# Altium project RK_NVR_DEMO1_RK3588_LP4XD200P232SD8_V21_20211228.PrjPcb (part 4 of 19)

## Sheet 17.RK3588_HDMI_eDP Interface.SchDoc
size 420 x 297 mm; Revision: V2.1; Schematic Page Number: 11; Page Number: 17; Check: <Checker>; Schematic Name: RK_NVR_DEMO1_RK3588_LP4/4x_V21; Page Count: 43; Page name: 17.RK3588_HDMI/eDP Interface; Designer: Zhangdz; Schematic Page Count: 99; Revcode: V2.1; DsnPath: E:\Work\SBER\RK3588_SOM\temp\RK_NVR_DEMO1_RK3588_LP4XD200P232SD8_V21_20211228.DSN; SchematicName: RK_NVR_DEMO1_RK3588_LP4/4x_V21; PageName: 17.RK3588_HDMI/eDP Interface; PageSize: A3; TopSchematic: True
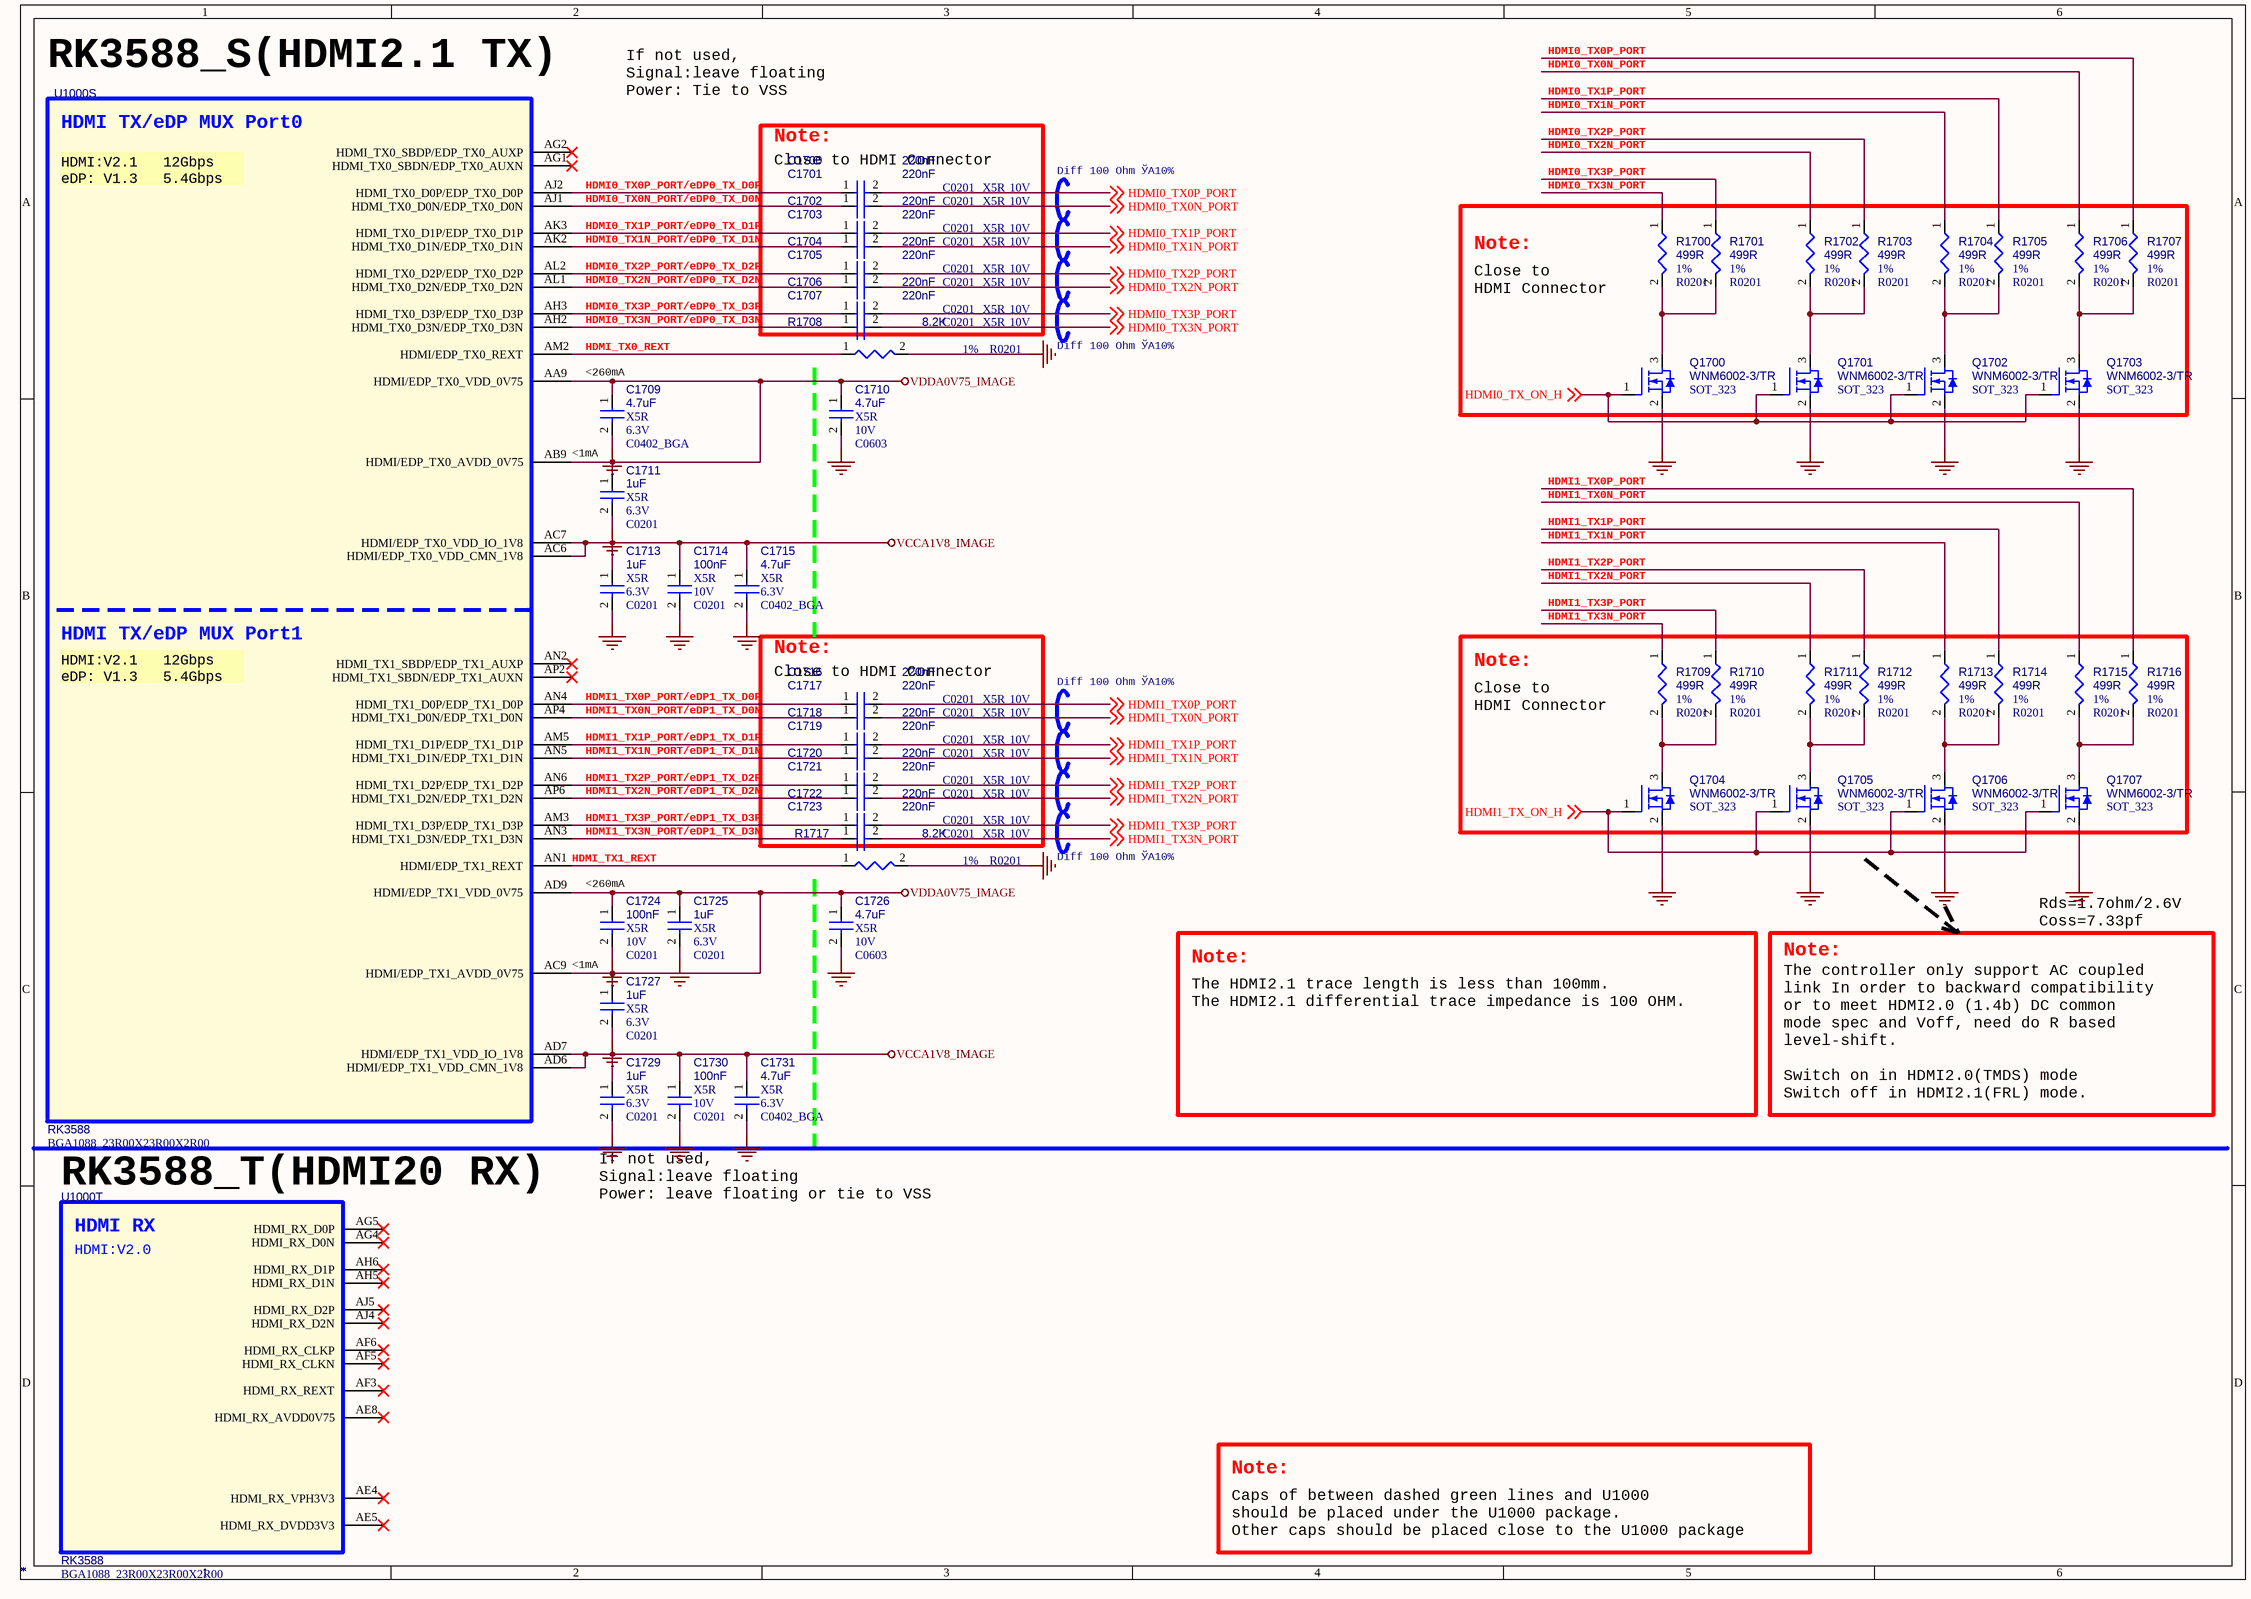
[diagram p32: 17.RK3588_HDMI_eDP Interface.SchDoc]

### Parts
C1700  *  Voltage: 10V  Dielectric: X5R  [C0201]
C1701  *  Voltage: 10V  Dielectric: X5R  [C0201]
C1702  *  Voltage: 10V  Dielectric: X5R  [C0201]
C1703  *  Voltage: 10V  Dielectric: X5R  [C0201]
C1704  *  Voltage: 10V  Dielectric: X5R  [C0201]
C1705  *  Voltage: 10V  Dielectric: X5R  [C0201]
C1706  *  Voltage: 10V  Dielectric: X5R  [C0201]
C1707  *  Voltage: 10V  Dielectric: X5R  [C0201]
C1709  *  Voltage: 6.3V  Dielectric: X5R  [C0402_BGA]
C1710  *  Voltage: 10V  Dielectric: X5R  [C0603]
C1711  *  Voltage: 6.3V  Dielectric: X5R  [C0201]
C1713  *  Voltage: 6.3V  Dielectric: X5R  [C0201]
C1714  *  Voltage: 10V  Dielectric: X5R  [C0201]
C1715  *  Voltage: 6.3V  Dielectric: X5R  [C0402_BGA]
C1716  *  Voltage: 10V  Dielectric: X5R  [C0201]
C1717  *  Voltage: 10V  Dielectric: X5R  [C0201]
C1718  *  Voltage: 10V  Dielectric: X5R  [C0201]
C1719  *  Voltage: 10V  Dielectric: X5R  [C0201]
C1720  *  Voltage: 10V  Dielectric: X5R  [C0201]
C1721  *  Voltage: 10V  Dielectric: X5R  [C0201]
C1722  *  Voltage: 10V  Dielectric: X5R  [C0201]
C1723  *  Voltage: 10V  Dielectric: X5R  [C0201]
C1724  *  Voltage: 10V  Dielectric: X5R  [C0201]
C1725  *  Voltage: 6.3V  Dielectric: X5R  [C0201]
C1726  *  Voltage: 10V  Dielectric: X5R  [C0603]
C1727  *  Voltage: 6.3V  Dielectric: X5R  [C0201]
C1729  *  Voltage: 6.3V  Dielectric: X5R  [C0201]
C1730  *  Voltage: 10V  Dielectric: X5R  [C0201]
C1731  *  Voltage: 6.3V  Dielectric: X5R  [C0402_BGA]
Q1700  *  PCB Footprint: SOT_323  [SOT23]
Q1701  *  PCB Footprint: SOT_323  [SOT23]
Q1702  *  PCB Footprint: SOT_323  [SOT23]
Q1703  *  PCB Footprint: SOT_323  [SOT23]
Q1704  *  PCB Footprint: SOT_323  [SOT23]
Q1705  *  PCB Footprint: SOT_323  [SOT23]
Q1706  *  PCB Footprint: SOT_323  [SOT23]
Q1707  *  PCB Footprint: SOT_323  [SOT23]
R1700  *  PCB Footprint: R0201  Tolerance: 1%  [R0402]
R1701  *  PCB Footprint: R0201  Tolerance: 1%  [R0402]
R1702  *  PCB Footprint: R0201  Tolerance: 1%  [R0402]
R1703  *  PCB Footprint: R0201  Tolerance: 1%  [R0402]
R1704  *  PCB Footprint: R0201  Tolerance: 1%  [R0402]
R1705  *  PCB Footprint: R0201  Tolerance: 1%  [R0402]
R1706  *  PCB Footprint: R0201  Tolerance: 1%  [R0402]
R1707  *  PCB Footprint: R0201  Tolerance: 1%  [R0402]
R1708  *  PCB Footprint: R0201  Tolerance: 1%  [R0402]
R1709  *  PCB Footprint: R0201  Tolerance: 1%  [R0402]
R1710  *  PCB Footprint: R0201  Tolerance: 1%  [R0402]
R1711  *  PCB Footprint: R0201  Tolerance: 1%  [R0402]
R1712  *  PCB Footprint: R0201  Tolerance: 1%  [R0402]
R1713  *  PCB Footprint: R0201  Tolerance: 1%  [R0402]
R1714  *  PCB Footprint: R0201  Tolerance: 1%  [R0402]
R1715  *  PCB Footprint: R0201  Tolerance: 1%  [R0402]
R1716  *  PCB Footprint: R0201  Tolerance: 1%  [R0402]
R1717  *  PCB Footprint: R0201  Tolerance: 1%  [R0402]
U1000  *  [BGA1088_23R00X23R00X2R00]  (parts S,T of 26)

### Blocks framed on the sheet
Note:: C1700-C1707
Note:: Q1700-Q1703 R1700-R1707
Note:: C1716-C1723
Note:: Q1704-Q1707 R1709-R1716

### Nets
GND: C1709.2 C1710.2 C1711.2 C1713.2 C1714.2 C1715.2 C1724.2 C1725.2 C1726.2 C1727.2 C1729.2 C1730.2 C1731.2 Q1700.2(SOURCE) Q1701.2(SOURCE) Q1702.2(SOURCE) Q1703.2(SOURCE) Q1704.2(SOURCE) Q1705.2(SOURCE) Q1706.2(SOURCE) Q1707.2(SOURCE) R1708.2 R1717.2
VCCA1V8_IMAGE: C1713.1 C1714.1 C1715.1 C1729.1 C1730.1 C1731.1 U1000.AC6(HDMI/EDP_TX0_VDD_CMN_1V8) U1000.AC7(HDMI/EDP_TX0_VDD_IO_1V8) U1000.AD6(HDMI/EDP_TX1_VDD_CMN_1V8) U1000.AD7(HDMI/EDP_TX1_VDD_IO_1V8)
VDDA0V75_IMAGE: C1709.1 C1710.1 C1711.1 C1724.1 C1725.1 C1726.1 C1727.1 U1000.AA9(HDMI/EDP_TX0_VDD_0V75) U1000.AB9(HDMI/EDP_TX0_AVDD_0V75) U1000.AC9(HDMI/EDP_TX1_AVDD_0V75) U1000.AD9(HDMI/EDP_TX1_VDD_0V75)
HDMI0_TX0N_PORT: C1701.2 R1706.1 ; off-sheet HDMI0_TX0N_PORT
HDMI0_TX0N_PORT/eDP0_TX_D0N: C1701.1 U1000.AJ1(HDMI_TX0_D0N/EDP_TX0_D0N)
HDMI0_TX0P_PORT: C1700.2 R1707.1 ; off-sheet HDMI0_TX0P_PORT
HDMI0_TX0P_PORT/eDP0_TX_D0P: C1700.1 U1000.AJ2(HDMI_TX0_D0P/EDP_TX0_D0P)
HDMI0_TX1N_PORT: C1703.2 R1704.1 ; off-sheet HDMI0_TX1N_PORT
HDMI0_TX1N_PORT/eDP0_TX_D1N: C1703.1 U1000.AK2(HDMI_TX0_D1N/EDP_TX0_D1N)
HDMI0_TX1P_PORT: C1702.2 R1705.1 ; off-sheet HDMI0_TX1P_PORT
HDMI0_TX1P_PORT/eDP0_TX_D1P: C1702.1 U1000.AK3(HDMI_TX0_D1P/EDP_TX0_D1P)
HDMI0_TX2N_PORT: C1705.2 R1702.1 ; off-sheet HDMI0_TX2N_PORT
HDMI0_TX2N_PORT/eDP0_TX_D2N: C1705.1 U1000.AL1(HDMI_TX0_D2N/EDP_TX0_D2N)
HDMI0_TX2P_PORT: C1704.2 R1703.1 ; off-sheet HDMI0_TX2P_PORT
HDMI0_TX2P_PORT/eDP0_TX_D2P: C1704.1 U1000.AL2(HDMI_TX0_D2P/EDP_TX0_D2P)
HDMI0_TX3N_PORT: C1707.2 R1700.1 ; off-sheet HDMI0_TX3N_PORT
HDMI0_TX3N_PORT/eDP0_TX_D3N: C1707.1 U1000.AH2(HDMI_TX0_D3N/EDP_TX0_D3N)
HDMI0_TX3P_PORT: C1706.2 R1701.1 ; off-sheet HDMI0_TX3P_PORT
HDMI0_TX3P_PORT/eDP0_TX_D3P: C1706.1 U1000.AH3(HDMI_TX0_D3P/EDP_TX0_D3P)
HDMI0_TX_ON_H: Q1700.1(GATE) Q1701.1(GATE) Q1702.1(GATE) Q1703.1(GATE) ; off-sheet HDMI0_TX_ON_H
HDMI1_TX0N_PORT: C1717.2 R1715.1 ; off-sheet HDMI1_TX0N_PORT
HDMI1_TX0N_PORT/eDP1_TX_D0N: C1717.1 U1000.AP4(HDMI_TX1_D0N/EDP_TX1_D0N)
HDMI1_TX0P_PORT: C1716.2 R1716.1 ; off-sheet HDMI1_TX0P_PORT
HDMI1_TX0P_PORT/eDP1_TX_D0P: C1716.1 U1000.AN4(HDMI_TX1_D0P/EDP_TX1_D0P)
HDMI1_TX1N_PORT: C1719.2 R1713.1 ; off-sheet HDMI1_TX1N_PORT
HDMI1_TX1N_PORT/eDP1_TX_D1N: C1719.1 U1000.AN5(HDMI_TX1_D1N/EDP_TX1_D1N)
HDMI1_TX1P_PORT: C1718.2 R1714.1 ; off-sheet HDMI1_TX1P_PORT
HDMI1_TX1P_PORT/eDP1_TX_D1P: C1718.1 U1000.AM5(HDMI_TX1_D1P/EDP_TX1_D1P)
HDMI1_TX2N_PORT: C1721.2 R1711.1 ; off-sheet HDMI1_TX2N_PORT
HDMI1_TX2N_PORT/eDP1_TX_D2N: C1721.1 U1000.AP6(HDMI_TX1_D2N/EDP_TX1_D2N)
HDMI1_TX2P_PORT: C1720.2 R1712.1 ; off-sheet HDMI1_TX2P_PORT
HDMI1_TX2P_PORT/eDP1_TX_D2P: C1720.1 U1000.AN6(HDMI_TX1_D2P/EDP_TX1_D2P)
HDMI1_TX3N_PORT: C1723.2 R1709.1 ; off-sheet HDMI1_TX3N_PORT
HDMI1_TX3N_PORT/eDP1_TX_D3N: C1723.1 U1000.AN3(HDMI_TX1_D3N/EDP_TX1_D3N)
HDMI1_TX3P_PORT: C1722.2 R1710.1 ; off-sheet HDMI1_TX3P_PORT
HDMI1_TX3P_PORT/eDP1_TX_D3P: C1722.1 U1000.AM3(HDMI_TX1_D3P/EDP_TX1_D3P)
HDMI1_TX_ON_H: Q1704.1(GATE) Q1705.1(GATE) Q1706.1(GATE) Q1707.1(GATE) ; off-sheet HDMI1_TX_ON_H
HDMI_TX0_REXT: R1708.1 U1000.AM2(HDMI/EDP_TX0_REXT)
HDMI_TX1_REXT: R1717.1 U1000.AN1(HDMI/EDP_TX1_REXT)
NetQ1700_3: Q1700.3(DRAIN) R1700.2 R1701.2
NetQ1701_3: Q1701.3(DRAIN) R1702.2 R1703.2
NetQ1702_3: Q1702.3(DRAIN) R1704.2 R1705.2
NetQ1703_3: Q1703.3(DRAIN) R1706.2 R1707.2
NetQ1704_3: Q1704.3(DRAIN) R1709.2 R1710.2
NetQ1705_3: Q1705.3(DRAIN) R1711.2 R1712.2
NetQ1706_3: Q1706.3(DRAIN) R1713.2 R1714.2
NetQ1707_3: Q1707.3(DRAIN) R1715.2 R1716.2

Not connected (* = marked no-connect by the designer): U1000 AE4(HDMI_RX_VPH3V3)* AE5(HDMI_RX_DVDD3V3)* AE8(HDMI_RX_AVDD0V75)* AF3(HDMI_RX_REXT)* AF5(HDMI_RX_CLKN)* AF6(HDMI_RX_CLKP)* AG1(HDMI_TX0_SBDN/EDP_TX0_AUXN)* AG2(HDMI_TX0_SBDP/EDP_TX0_AUXP)* AG4(HDMI_RX_D0N)* AG5(HDMI_RX_D0P)* AH5(HDMI_RX_D1N)* AH6(HDMI_RX_D1P)* AJ4(HDMI_RX_D2N)* AJ5(HDMI_RX_D2P)* AN2(HDMI_TX1_SBDP/EDP_TX1_AUXP)* AP2(HDMI_TX1_SBDN/EDP_TX1_AUXN)*

### Notes on the sheet
- RK3588_S(HDMI2.1 TX)
- If not used,
  Signal:leave floating
  Power: Tie to VSS
- Close to HDMI Connector
- Diff 100 Ohm ЎА10%
- (near R1700) Close to
  HDMI Connector
- (near C1709) <260mA
- <1mA
- (near R1709) Close to
  HDMI Connector
- (near C1724) <260mA
- Rds=1.7ohm/2.6V
  Coss=7.33pf
- Note:
- The HDMI2.1 trace length is less than 100mm.
  The HDMI2.1 differential trace impedance is 100 OHM.
- The controller only support AC coupled
  link In order to backward compatibility
  or to meet HDMI2.0 (1.4b) DC common
  mode spec and Voff, need do R based
  level-shift.
  Switch on in HDMI2.0(TMDS) mode
  Switch off in HDMI2.1(FRL) mode.
- (near U1000) RK3588_T(HDMI20 RX)
- If not used,
  Signal:leave floating
  Power: leave floating or tie to VSS
- Caps of between dashed green lines and U1000
  should be placed under the U1000 package.
  Other caps should be placed close to the U1000 package
- (in symbol SOC_RK3588, part S) HDMI TX/eDP MUX Port0; HDMI:V2.1   12Gbps / eDP: V1.3   5.4Gbps; HDMI TX/eDP MUX Port1
- (in symbol SOC_RK3588, part T) HDMI RX; HDMI:V2.0

### Library data of the parts
C1700 = CAP NP: cap,220.00nF,+/-10%,10V,X5R,C0201; Part Reference: C1700; Manufacturer: TDK; Value: 220nF; RK PN: C0603X5R1A224K030BB; Priority: A; Tolerance: 10%; PCB Footprint: C0201; Part Type: C0201; Manufacturer PN: C0603X5R1A224K030BB; Created by: JJJ
C1701 = CAP NP: cap,220.00nF,+/-10%,10V,X5R,C0201; Part Reference: C1701; Manufacturer PN: C0603X5R1A224K030BB; Manufacturer: TDK; Value: 220nF; Tolerance: 10%; Priority: A; PCB Footprint: C0201; Created by: JJJ; Part Type: C0201; RK PN: C0603X5R1A224K030BB
C1702 = CAP NP: cap,220.00nF,+/-10%,10V,X5R,C0201; Part Reference: C1702; Manufacturer: TDK; Value: 220nF; RK PN: C0603X5R1A224K030BB; Priority: A; Tolerance: 10%; PCB Footprint: C0201; Part Type: C0201; Manufacturer PN: C0603X5R1A224K030BB; Created by: JJJ
C1703 = CAP NP: cap,220.00nF,+/-10%,10V,X5R,C0201; Part Reference: C1703; Manufacturer PN: C0603X5R1A224K030BB; Manufacturer: TDK; Value: 220nF; Tolerance: 10%; Priority: A; PCB Footprint: C0201; Created by: JJJ; Part Type: C0201; RK PN: C0603X5R1A224K030BB
C1704 = CAP NP: cap,220.00nF,+/-10%,10V,X5R,C0201; Part Reference: C1704; Manufacturer: TDK; Value: 220nF; RK PN: C0603X5R1A224K030BB; Priority: A; Tolerance: 10%; PCB Footprint: C0201; Part Type: C0201; Manufacturer PN: C0603X5R1A224K030BB; Created by: JJJ
C1705 = CAP NP: cap,220.00nF,+/-10%,10V,X5R,C0201; Part Reference: C1705; Manufacturer PN: C0603X5R1A224K030BB; Manufacturer: TDK; Value: 220nF; Tolerance: 10%; Priority: A; PCB Footprint: C0201; Created by: JJJ; Part Type: C0201; RK PN: C0603X5R1A224K030BB
C1706 = CAP NP: cap,220.00nF,+/-10%,10V,X5R,C0201; Part Reference: C1706; Manufacturer: TDK; Value: 220nF; RK PN: C0603X5R1A224K030BB; Priority: A; Tolerance: 10%; PCB Footprint: C0201; Part Type: C0201; Manufacturer PN: C0603X5R1A224K030BB; Created by: JJJ
C1707 = CAP NP: cap,220.00nF,+/-10%,10V,X5R,C0201; Part Reference: C1707; Manufacturer: TDK; Value: 220nF; RK PN: C0603X5R1A224K030BB; Priority: A; Tolerance: 10%; PCB Footprint: C0201; Part Type: C0201; Manufacturer PN: C0603X5R1A224K030BB; Created by: JJJ
C1709 = CAP NP: cap,4.70uF,+/-10%,6.3V,X5R,C0402; Part Reference: C1709; Manufacturer PN: C1005X5R0J475K050BC; Manufacturer: TDK; Value: 4.7uF; Tolerance: 10%; Priority: A; PCB Footprint: C0402_BGA; Created by: JJJ; Part Type: C0402; RK PN: C1005X5R0J475K050BC
C1710 = CAP NP: cap,4.70uF,+/-10%,10V,X5R,C0603; Part Reference: C1710; Manufacturer PN: C1608X5R1A475K080AC; Manufacturer: TDK; Value: 4.7uF; Tolerance: 10%; Priority: A; PCB Footprint: C0603; Created by: JJJ; Part Type: C0603; RK PN: C1608X5R1A475K080AC
C1711 = CAP NP: cap,1.00uF,+/-20%,6.3V,X5R,C0201; Part Reference: C1711; Manufacturer PN: C0603X5R0J105M030BC; Manufacturer: TDK; Value: 1uF; Tolerance: 20%; Priority: A; PCB Footprint: C0201; Created by: JJJ; Part Type: C0201; RK PN: C0603X5R0J105M030BC
C1713 = CAP NP: cap,1.00uF,+/-20%,6.3V,X5R,C0201; Part Reference: C1713; Manufacturer: TDK; Value: 1uF; RK PN: C0603X5R0J105M030BC; Priority: A; Tolerance: 20%; PCB Footprint: C0201; Part Type: C0201; Manufacturer PN: C0603X5R0J105M030BC; Created by: JJJ
C1714 = CAP NP: cap,100.00nF,+/-10%,10V,X5R,C0201; Part Reference: C1714; Manufacturer PN: C0603X5R1A104K030BC; Manufacturer: TDK; Value: 100nF; Tolerance: 10%; Priority: A; PCB Footprint: C0201; Created by: JJJ; Part Type: C0201; RK PN: C0603X5R1A104K030BC
C1715 = CAP NP: cap,4.70uF,+/-10%,6.3V,X5R,C0402; Part Reference: C1715; Manufacturer: TDK; Value: 4.7uF; RK PN: C1005X5R0J475K050BC; Priority: A; Tolerance: 10%; PCB Footprint: C0402_BGA; Part Type: C0402; Manufacturer PN: C1005X5R0J475K050BC; Created by: JJJ
C1716 = CAP NP: cap,220.00nF,+/-10%,10V,X5R,C0201; Part Reference: C1716; Manufacturer: TDK; Value: 220nF; RK PN: C0603X5R1A224K030BB; Priority: A; Tolerance: 10%; PCB Footprint: C0201; Part Type: C0201; Manufacturer PN: C0603X5R1A224K030BB; Created by: JJJ
C1717 = CAP NP: cap,220.00nF,+/-10%,10V,X5R,C0201; Part Reference: C1717; Manufacturer PN: C0603X5R1A224K030BB; Manufacturer: TDK; Value: 220nF; Tolerance: 10%; Priority: A; PCB Footprint: C0201; Created by: JJJ; Part Type: C0201; RK PN: C0603X5R1A224K030BB
C1718 = CAP NP: cap,220.00nF,+/-10%,10V,X5R,C0201; Part Reference: C1718; Manufacturer: TDK; Value: 220nF; RK PN: C0603X5R1A224K030BB; Priority: A; Tolerance: 10%; PCB Footprint: C0201; Part Type: C0201; Manufacturer PN: C0603X5R1A224K030BB; Created by: JJJ
C1719 = CAP NP: cap,220.00nF,+/-10%,10V,X5R,C0201; Part Reference: C1719; Manufacturer PN: C0603X5R1A224K030BB; Manufacturer: TDK; Value: 220nF; Tolerance: 10%; Priority: A; PCB Footprint: C0201; Created by: JJJ; Part Type: C0201; RK PN: C0603X5R1A224K030BB
C1720 = CAP NP: cap,220.00nF,+/-10%,10V,X5R,C0201; Part Reference: C1720; Manufacturer: TDK; Value: 220nF; RK PN: C0603X5R1A224K030BB; Priority: A; Tolerance: 10%; PCB Footprint: C0201; Part Type: C0201; Manufacturer PN: C0603X5R1A224K030BB; Created by: JJJ
C1721 = CAP NP: cap,220.00nF,+/-10%,10V,X5R,C0201; Part Reference: C1721; Manufacturer PN: C0603X5R1A224K030BB; Manufacturer: TDK; Value: 220nF; Tolerance: 10%; Priority: A; PCB Footprint: C0201; Created by: JJJ; Part Type: C0201; RK PN: C0603X5R1A224K030BB
C1722 = CAP NP: cap,220.00nF,+/-10%,10V,X5R,C0201; Part Reference: C1722; Manufacturer: TDK; Value: 220nF; RK PN: C0603X5R1A224K030BB; Priority: A; Tolerance: 10%; PCB Footprint: C0201; Part Type: C0201; Manufacturer PN: C0603X5R1A224K030BB; Created by: JJJ
C1723 = CAP NP: cap,220.00nF,+/-10%,10V,X5R,C0201; Part Reference: C1723; Manufacturer: TDK; Value: 220nF; RK PN: C0603X5R1A224K030BB; Priority: A; Tolerance: 10%; PCB Footprint: C0201; Part Type: C0201; Manufacturer PN: C0603X5R1A224K030BB; Created by: JJJ
C1724 = CAP NP: cap,100.00nF,+/-10%,10V,X5R,C0201; Part Reference: C1724; Manufacturer PN: C0603X5R1A104K030BC; Manufacturer: TDK; Value: 100nF; Tolerance: 10%; Priority: A; PCB Footprint: C0201; Created by: JJJ; Part Type: C0201; RK PN: C0603X5R1A104K030BC
C1725 = CAP NP: cap,1.00uF,+/-20%,6.3V,X5R,C0201; Part Reference: C1725; Manufacturer: TDK; Value: 1uF; RK PN: C0603X5R0J105M030BC; Priority: A; Tolerance: 20%; PCB Footprint: C0201; Part Type: C0201; Manufacturer PN: C0603X5R0J105M030BC; Created by: JJJ
C1726 = CAP NP: cap,4.70uF,+/-10%,10V,X5R,C0603; Part Reference: C1726; Manufacturer: TDK; Value: 4.7uF; RK PN: C1608X5R1A475K080AC; Priority: A; Tolerance: 10%; PCB Footprint: C0603; Part Type: C0603; Manufacturer PN: C1608X5R1A475K080AC; Created by: JJJ
C1727 = CAP NP: cap,1.00uF,+/-20%,6.3V,X5R,C0201; Part Reference: C1727; Manufacturer PN: C0603X5R0J105M030BC; Manufacturer: TDK; Value: 1uF; Tolerance: 20%; Priority: A; PCB Footprint: C0201; Created by: JJJ; Part Type: C0201; RK PN: C0603X5R0J105M030BC
C1729 = CAP NP: cap,1.00uF,+/-20%,6.3V,X5R,C0201; Part Reference: C1729; Manufacturer: TDK; Value: 1uF; RK PN: C0603X5R0J105M030BC; Priority: A; Tolerance: 20%; PCB Footprint: C0201; Part Type: C0201; Manufacturer PN: C0603X5R0J105M030BC; Created by: JJJ
C1730 = CAP NP: cap,100.00nF,+/-10%,10V,X5R,C0201; Part Reference: C1730; Manufacturer PN: C0603X5R1A104K030BC; Manufacturer: TDK; Value: 100nF; Tolerance: 10%; Priority: A; PCB Footprint: C0201; Created by: JJJ; Part Type: C0201; RK PN: C0603X5R1A104K030BC
C1731 = CAP NP: cap,4.70uF,+/-10%,6.3V,X5R,C0402; Part Reference: C1731; Manufacturer: TDK; Value: 4.7uF; RK PN: C1005X5R0J475K050BC; Priority: A; Tolerance: 10%; PCB Footprint: C0402_BGA; Part Type: C0402; Manufacturer PN: C1005X5R0J475K050BC; Created by: JJJ
Q1700 = MOSFET N: NMOS,WNM6002-3/TR,SOT_323,Id=0.3A,Vds=60V; Part Reference: Q1700; Manufacturer: WillSemi(О¤¶ы°лµјМе); Pd: 0.23W; Vgsth: 1.3V; VDS: 60V; Vgs: ЎА20V; Id_max: 0.3A; Priority: A; Value: WNM6002-3/TR; Created by: JJJ; Manufacturer PN: WNM6002-3/TR; Part Type: NMOS; RK PN: WNM6002-3/TR
Q1701 = MOSFET N: NMOS,WNM6002-3/TR,SOT_323,Id=0.3A,Vds=60V; Part Reference: Q1701; Manufacturer: WillSemi(О¤¶ы°лµјМе); Pd: 0.23W; Vgsth: 1.3V; VDS: 60V; Vgs: ЎА20V; Id_max: 0.3A; Priority: A; Value: WNM6002-3/TR; Created by: JJJ; Manufacturer PN: WNM6002-3/TR; Part Type: NMOS; RK PN: WNM6002-3/TR
Q1702 = MOSFET N: NMOS,WNM6002-3/TR,SOT_323,Id=0.3A,Vds=60V; Part Reference: Q1702; Manufacturer: WillSemi(О¤¶ы°лµјМе); Pd: 0.23W; Vgsth: 1.3V; VDS: 60V; Vgs: ЎА20V; Id_max: 0.3A; Priority: A; Value: WNM6002-3/TR; Created by: JJJ; Manufacturer PN: WNM6002-3/TR; Part Type: NMOS; RK PN: WNM6002-3/TR
Q1703 = MOSFET N: NMOS,WNM6002-3/TR,SOT_323,Id=0.3A,Vds=60V; Part Reference: Q1703; Manufacturer: WillSemi(О¤¶ы°лµјМе); Priority: A; Id_max: 0.3A; Vgs: ЎА20V; VDS: 60V; Vgsth: 1.3V; Pd: 0.23W; Value: WNM6002-3/TR; RK PN: WNM6002-3/TR; Part Type: NMOS; Manufacturer PN: WNM6002-3/TR; Created by: JJJ
Q1704 = MOSFET N: NMOS,WNM6002-3/TR,SOT_323,Id=0.3A,Vds=60V; Part Reference: Q1704; Manufacturer: WillSemi(О¤¶ы°лµјМе); Priority: A; Id_max: 0.3A; Vgs: ЎА20V; VDS: 60V; Vgsth: 1.3V; Pd: 0.23W; Value: WNM6002-3/TR; RK PN: WNM6002-3/TR; Part Type: NMOS; Manufacturer PN: WNM6002-3/TR; Created by: JJJ
Q1705 = MOSFET N: NMOS,WNM6002-3/TR,SOT_323,Id=0.3A,Vds=60V; Part Reference: Q1705; Manufacturer: WillSemi(О¤¶ы°лµјМе); Priority: A; Id_max: 0.3A; Vgs: ЎА20V; VDS: 60V; Vgsth: 1.3V; Pd: 0.23W; Value: WNM6002-3/TR; RK PN: WNM6002-3/TR; Part Type: NMOS; Manufacturer PN: WNM6002-3/TR; Created by: JJJ
Q1706 = MOSFET N: NMOS,WNM6002-3/TR,SOT_323,Id=0.3A,Vds=60V; Part Reference: Q1706; Manufacturer: WillSemi(О¤¶ы°лµјМе); Priority: A; Id_max: 0.3A; Vgs: ЎА20V; VDS: 60V; Vgsth: 1.3V; Pd: 0.23W; Value: WNM6002-3/TR; RK PN: WNM6002-3/TR; Part Type: NMOS; Manufacturer PN: WNM6002-3/TR; Created by: JJJ
Q1707 = MOSFET N: NMOS,WNM6002-3/TR,SOT_323,Id=0.3A,Vds=60V; Part Reference: Q1707; Manufacturer: WillSemi(О¤¶ы°лµјМе); Pd: 0.23W; Vgsth: 1.3V; VDS: 60V; Vgs: ЎА20V; Id_max: 0.3A; Priority: A; Value: WNM6002-3/TR; Created by: JJJ; Manufacturer PN: WNM6002-3/TR; Part Type: NMOS; RK PN: WNM6002-3/TR
R1700 = RESISTOR_Dup1: НЁУГєсД¤µзЧи,499R,+/-1%,R0201,1/20W.; Part Reference: R1700; Manufacturer PN: RC0201FR-07499RL; Manufacturer: YAGEO; Wattage: 1/20W; Priority: A; Value: 499R; Created by: YTL; Part Type: НЁУГєсД¤µзЧи; RK PN: RC0201FR-07499RL
R1701 = RESISTOR_Dup1: НЁУГєсД¤µзЧи,499R,+/-1%,R0201,1/20W.; Part Reference: R1701; Manufacturer: YAGEO; RK PN: RC0201FR-07499RL; Priority: A; Wattage: 1/20W; Value: 499R; Part Type: НЁУГєсД¤µзЧи; Manufacturer PN: RC0201FR-07499RL; Created by: YTL
R1702 = RESISTOR_Dup1: НЁУГєсД¤µзЧи,499R,+/-1%,R0201,1/20W.; Part Reference: R1702; Manufacturer: YAGEO; RK PN: RC0201FR-07499RL; Priority: A; Wattage: 1/20W; Value: 499R; Part Type: НЁУГєсД¤µзЧи; Manufacturer PN: RC0201FR-07499RL; Created by: YTL
R1703 = RESISTOR_Dup1: НЁУГєсД¤µзЧи,499R,+/-1%,R0201,1/20W.; Part Reference: R1703; Manufacturer: YAGEO; RK PN: RC0201FR-07499RL; Priority: A; Wattage: 1/20W; Value: 499R; Part Type: НЁУГєсД¤µзЧи; Manufacturer PN: RC0201FR-07499RL; Created by: YTL
R1704 = RESISTOR_Dup1: НЁУГєсД¤µзЧи,499R,+/-1%,R0201,1/20W.; Part Reference: R1704; Manufacturer PN: RC0201FR-07499RL; Manufacturer: YAGEO; Wattage: 1/20W; Priority: A; Value: 499R; Created by: YTL; Part Type: НЁУГєсД¤µзЧи; RK PN: RC0201FR-07499RL
R1705 = RESISTOR_Dup1: НЁУГєсД¤µзЧи,499R,+/-1%,R0201,1/20W.; Part Reference: R1705; Manufacturer PN: RC0201FR-07499RL; Manufacturer: YAGEO; Wattage: 1/20W; Priority: A; Value: 499R; Created by: YTL; Part Type: НЁУГєсД¤µзЧи; RK PN: RC0201FR-07499RL
R1706 = RESISTOR_Dup1: НЁУГєсД¤µзЧи,499R,+/-1%,R0201,1/20W.; Part Reference: R1706; Manufacturer PN: RC0201FR-07499RL; Manufacturer: YAGEO; Wattage: 1/20W; Priority: A; Value: 499R; Created by: YTL; Part Type: НЁУГєсД¤µзЧи; RK PN: RC0201FR-07499RL
R1707 = RESISTOR_Dup1: НЁУГєсД¤µзЧи,499R,+/-1%,R0201,1/20W.; Part Reference: R1707; Manufacturer: YAGEO; RK PN: RC0201FR-07499RL; Priority: A; Wattage: 1/20W; Value: 499R; Part Type: НЁУГєсД¤µзЧи; Manufacturer PN: RC0201FR-07499RL; Created by: YTL
R1708 = RESISTOR_Dup1: НЁУГєсД¤µзЧи,8K2,+/-1%,R0201,1/20W.; Part Reference: R1708; Manufacturer PN: RC0201FR-078K2L; Manufacturer: YAGEO; Value: 8.2K; Wattage: 1/20W; Priority: A; Created by: YTL; Part Type: НЁУГєсД¤µзЧи; RK PN: RC0201FR-078K2L
R1709 = RESISTOR_Dup1: НЁУГєсД¤µзЧи,499R,+/-1%,R0201,1/20W.; Part Reference: R1709; Manufacturer PN: RC0201FR-07499RL; Manufacturer: YAGEO; Wattage: 1/20W; Priority: A; Value: 499R; Created by: YTL; Part Type: НЁУГєсД¤µзЧи; RK PN: RC0201FR-07499RL
R1710 = RESISTOR_Dup1: НЁУГєсД¤µзЧи,499R,+/-1%,R0201,1/20W.; Part Reference: R1710; Manufacturer: YAGEO; RK PN: RC0201FR-07499RL; Priority: A; Wattage: 1/20W; Value: 499R; Part Type: НЁУГєсД¤µзЧи; Manufacturer PN: RC0201FR-07499RL; Created by: YTL
R1711 = RESISTOR_Dup1: НЁУГєсД¤µзЧи,499R,+/-1%,R0201,1/20W.; Part Reference: R1711; Manufacturer: YAGEO; RK PN: RC0201FR-07499RL; Priority: A; Wattage: 1/20W; Value: 499R; Part Type: НЁУГєсД¤µзЧи; Manufacturer PN: RC0201FR-07499RL; Created by: YTL
R1712 = RESISTOR_Dup1: НЁУГєсД¤µзЧи,499R,+/-1%,R0201,1/20W.; Part Reference: R1712; Manufacturer: YAGEO; RK PN: RC0201FR-07499RL; Priority: A; Wattage: 1/20W; Value: 499R; Part Type: НЁУГєсД¤µзЧи; Manufacturer PN: RC0201FR-07499RL; Created by: YTL
R1713 = RESISTOR_Dup1: НЁУГєсД¤µзЧи,499R,+/-1%,R0201,1/20W.; Part Reference: R1713; Manufacturer PN: RC0201FR-07499RL; Manufacturer: YAGEO; Wattage: 1/20W; Priority: A; Value: 499R; Created by: YTL; Part Type: НЁУГєсД¤µзЧи; RK PN: RC0201FR-07499RL
R1714 = RESISTOR_Dup1: НЁУГєсД¤µзЧи,499R,+/-1%,R0201,1/20W.; Part Reference: R1714; Manufacturer PN: RC0201FR-07499RL; Manufacturer: YAGEO; Wattage: 1/20W; Priority: A; Value: 499R; Created by: YTL; Part Type: НЁУГєсД¤µзЧи; RK PN: RC0201FR-07499RL
R1715 = RESISTOR_Dup1: НЁУГєсД¤µзЧи,499R,+/-1%,R0201,1/20W.; Part Reference: R1715; Manufacturer PN: RC0201FR-07499RL; Manufacturer: YAGEO; Wattage: 1/20W; Priority: A; Value: 499R; Created by: YTL; Part Type: НЁУГєсД¤µзЧи; RK PN: RC0201FR-07499RL
R1716 = RESISTOR_Dup1: НЁУГєсД¤µзЧи,499R,+/-1%,R0201,1/20W.; Part Reference: R1716; Manufacturer: YAGEO; RK PN: RC0201FR-07499RL; Priority: A; Wattage: 1/20W; Value: 499R; Part Type: НЁУГєсД¤µзЧи; Manufacturer PN: RC0201FR-07499RL; Created by: YTL
R1717 = RESISTOR_Dup1: НЁУГєсД¤µзЧи,8K2,+/-1%,R0201,1/20W.; Part Reference: R1717; Manufacturer PN: RC0201FR-078K2L; Manufacturer: YAGEO; Value: 8.2K; Wattage: 1/20W; Priority: A; Created by: YTL; Part Type: НЁУГєсД¤µзЧи; RK PN: RC0201FR-078K2L
U1000 = SOC_RK3588: as U1000 on sheet 14.RK3588_USB30_USB20_Ctrl; RK PN: RK3588; Part Type: SOC; Manufacturer PN: RK3588; Created by: YWQ; PCB Footprint: BGA1088_23R00X23R00X2R00

## Sheet 18.RK3588_PCIE30_PCIE20_SATA30.SchDoc
size 420 x 297 mm; Revision: V2.1; Schematic Page Number: 11; Page Number: 18; Check: <Checker>; Schematic Name: RK_NVR_DEMO1_RK3588_LP4/4x_V21; Page Count: 43; Page name: 18.RK3588_PCIE30/PCIE20/SATA30; Designer: Zhangdz; Schematic Page Count: 99; Revcode: V2.1; DsnPath: E:\Work\SBER\RK3588_SOM\temp\RK_NVR_DEMO1_RK3588_LP4XD200P232SD8_V21_20211228.DSN; SchematicName: RK_NVR_DEMO1_RK3588_LP4/4x_V21; PageName: 18.RK3588_PCIE30/PCIE20/SATA30; PageSize: A3; TopSchematic: True
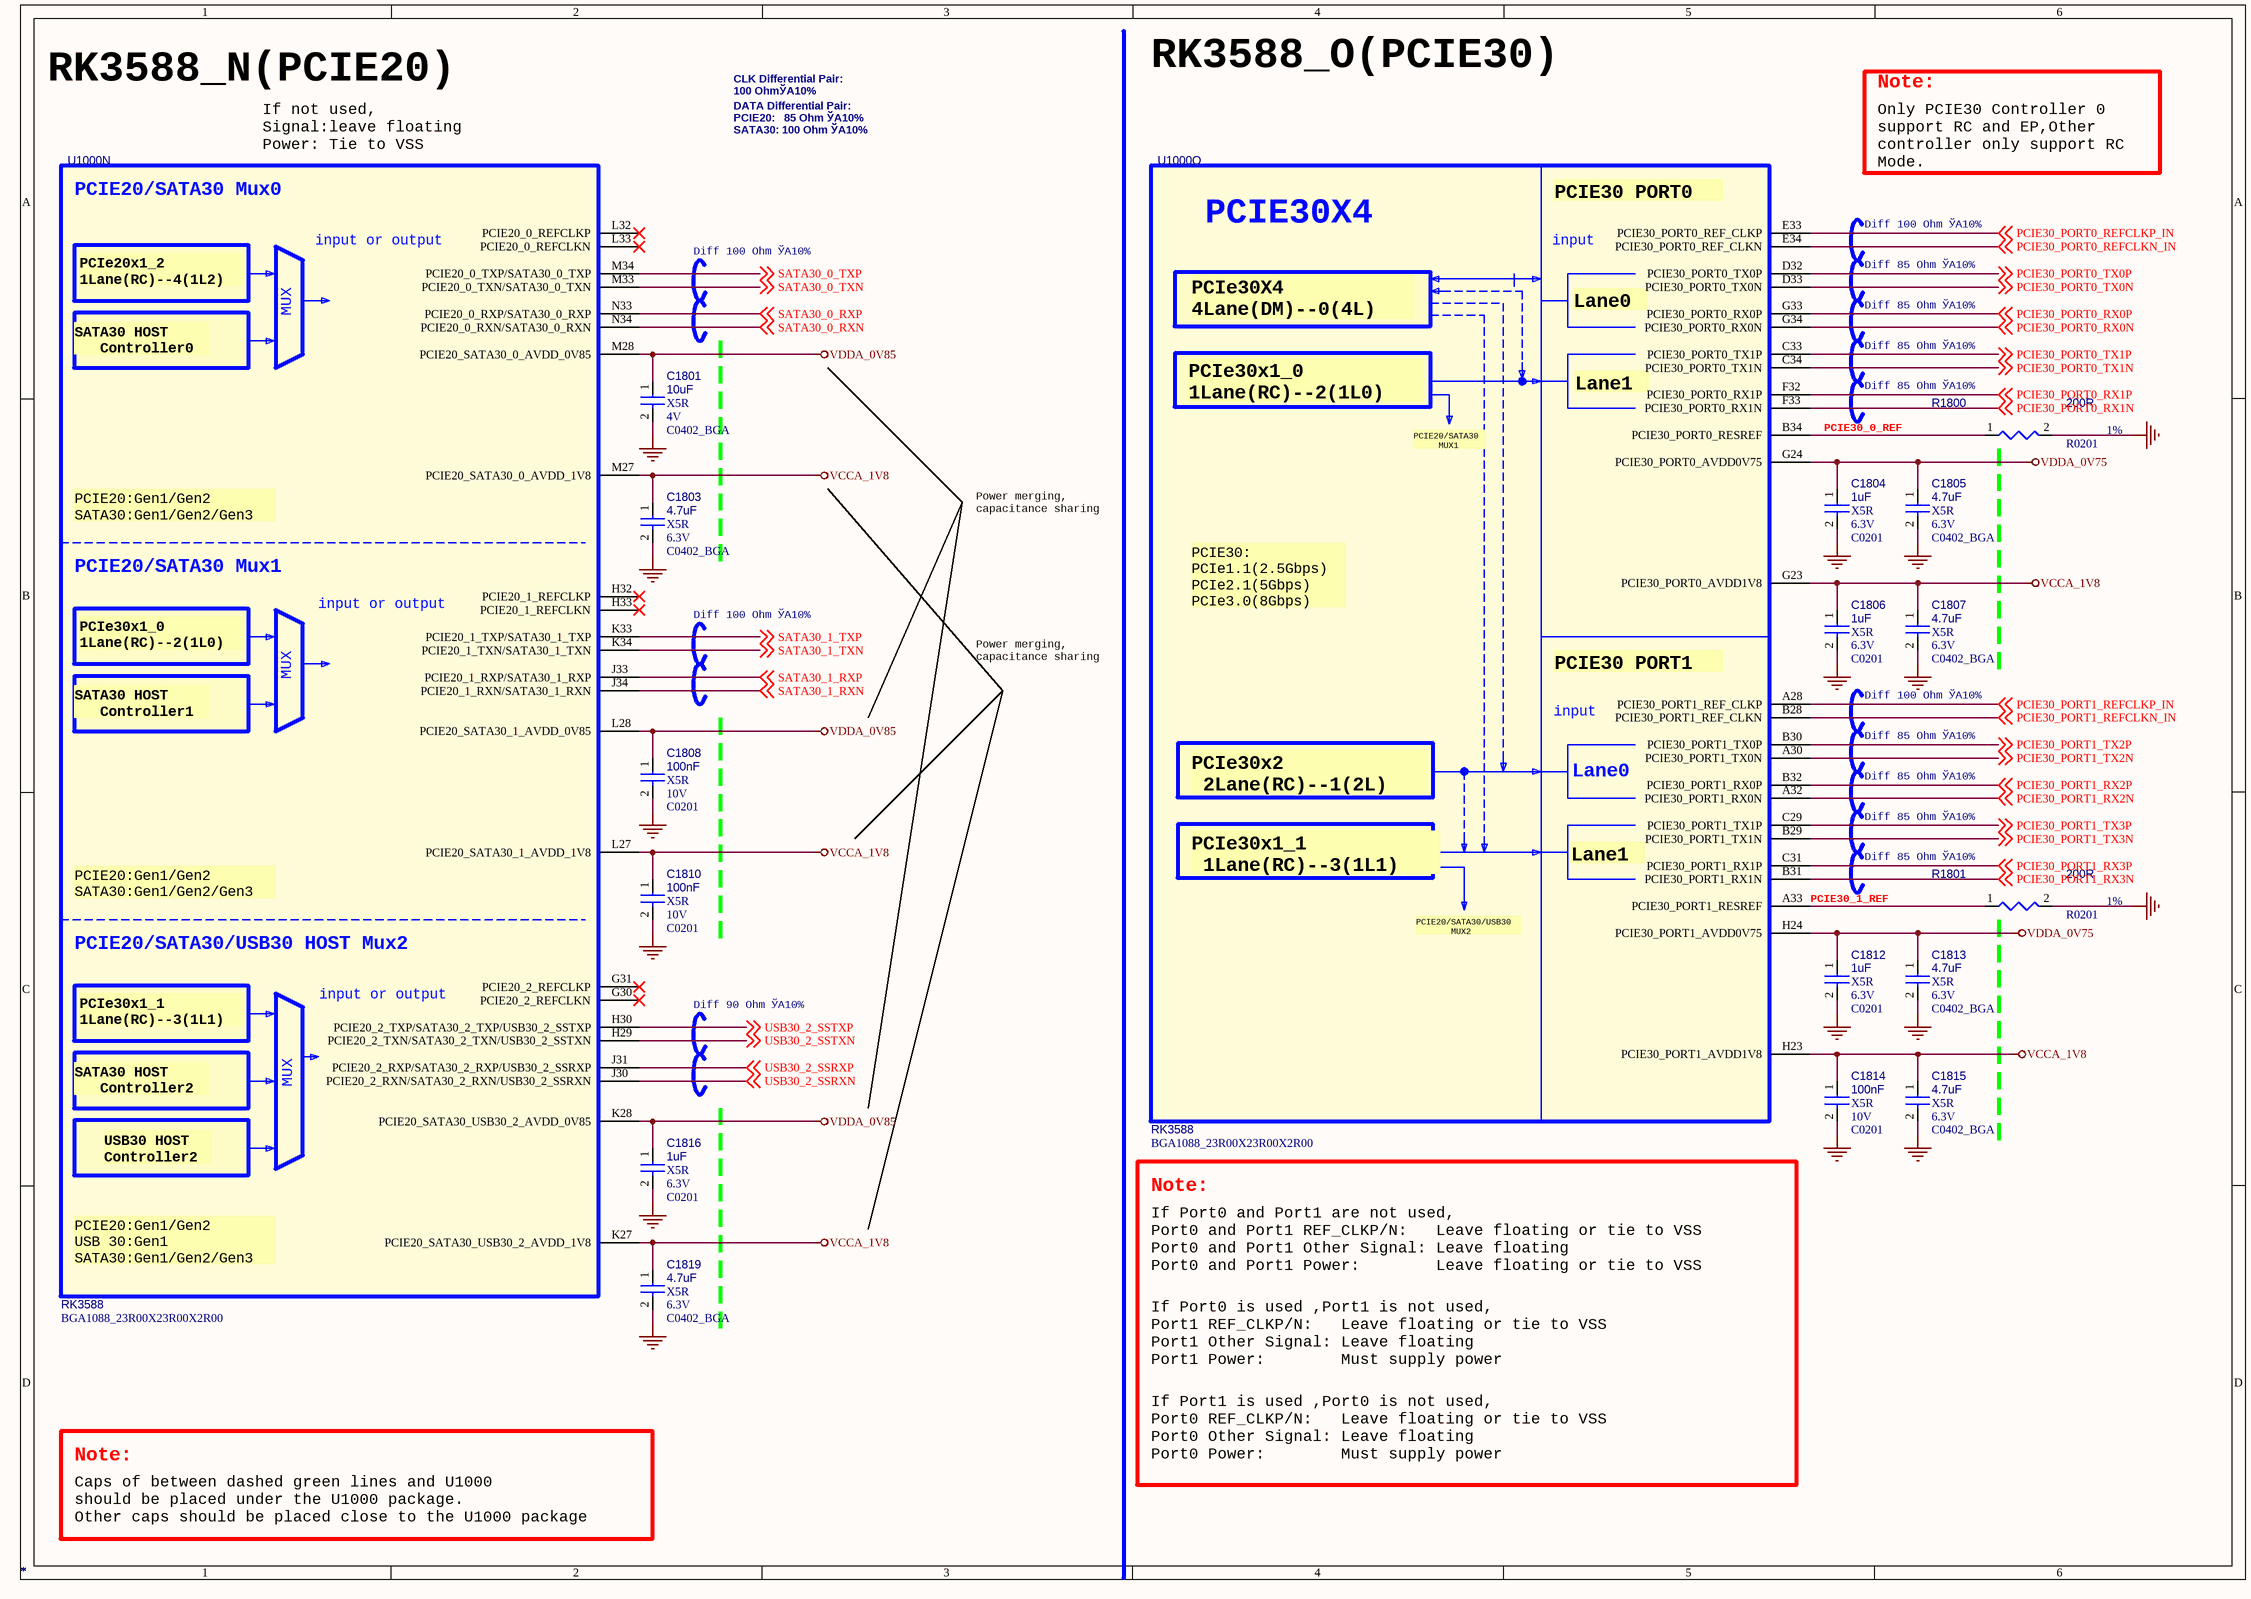
[diagram p33: 18.RK3588_PCIE30_PCIE20_SATA30.SchDoc]

### Parts
C1801  *  Voltage: 4V  Dielectric: X5R  [C0402_BGA]
C1803  *  Voltage: 6.3V  Dielectric: X5R  [C0402_BGA]
C1804  *  Voltage: 6.3V  Dielectric: X5R  [C0201]
C1805  *  Voltage: 6.3V  Dielectric: X5R  [C0402_BGA]
C1806  *  Voltage: 6.3V  Dielectric: X5R  [C0201]
C1807  *  Voltage: 6.3V  Dielectric: X5R  [C0402_BGA]
C1808  *  Voltage: 10V  Dielectric: X5R  [C0201]
C1810  *  Voltage: 10V  Dielectric: X5R  [C0201]
C1812  *  Voltage: 6.3V  Dielectric: X5R  [C0201]
C1813  *  Voltage: 6.3V  Dielectric: X5R  [C0402_BGA]
C1814  *  Voltage: 10V  Dielectric: X5R  [C0201]
C1815  *  Voltage: 6.3V  Dielectric: X5R  [C0402_BGA]
C1816  *  Voltage: 6.3V  Dielectric: X5R  [C0201]
C1819  *  Voltage: 6.3V  Dielectric: X5R  [C0402_BGA]
R1800  *  PCB Footprint: R0201  Tolerance: 1%  [R0402]
R1801  *  PCB Footprint: R0201  Tolerance: 1%  [R0402]
U1000  *  [BGA1088_23R00X23R00X2R00]  (parts N,O of 26)

### Nets
GND: C1801.2 C1803.2 C1804.2 C1805.2 C1806.2 C1807.2 C1808.2 C1810.2 C1812.2 C1813.2 C1814.2 C1815.2 C1816.2 C1819.2 R1800.2 R1801.2
VCCA_1V8: C1803.1 C1806.1 C1807.1 C1810.1 C1814.1 C1815.1 C1819.1 U1000.G23(PCIE30_PORT0_AVDD1V8) U1000.H23(PCIE30_PORT1_AVDD1V8) U1000.K27(PCIE20_SATA30_USB30_2_AVDD_1V8) U1000.L27(PCIE20_SATA30_1_AVDD_1V8) U1000.M27(PCIE20_SATA30_0_AVDD_1V8)
VDDA_0V75: C1804.1 C1805.1 C1812.1 C1813.1 U1000.G24(PCIE30_PORT0_AVDD0V75) U1000.H24(PCIE30_PORT1_AVDD0V75)
VDDA_0V85: C1801.1 C1808.1 C1816.1 U1000.K28(PCIE20_SATA30_USB30_2_AVDD_0V85) U1000.L28(PCIE20_SATA30_1_AVDD_0V85) U1000.M28(PCIE20_SATA30_0_AVDD_0V85)
PCIE30_0_REF: R1800.1 U1000.B34(PCIE30_PORT0_RESREF)
PCIE30_1_REF: R1801.1 U1000.A33(PCIE30_PORT1_RESREF)
PCIE30_PORT0_REFCLKN_IN: U1000.E34(PCIE30_PORT0_REF_CLKN) ; off-sheet PCIE30_PORT0_REFCLKN_IN
PCIE30_PORT0_REFCLKP_IN: U1000.E33(PCIE30_PORT0_REF_CLKP) ; off-sheet PCIE30_PORT0_REFCLKP_IN
PCIE30_PORT0_RX0N: U1000.G34(PCIE30_PORT0_RX0N) ; off-sheet PCIE30_PORT0_RX0N
PCIE30_PORT0_RX0P: U1000.G33(PCIE30_PORT0_RX0P) ; off-sheet PCIE30_PORT0_RX0P
PCIE30_PORT0_RX1N: U1000.F33(PCIE30_PORT0_RX1N) ; off-sheet PCIE30_PORT0_RX1N
PCIE30_PORT0_RX1P: U1000.F32(PCIE30_PORT0_RX1P) ; off-sheet PCIE30_PORT0_RX1P
PCIE30_PORT0_TX0N: U1000.D33(PCIE30_PORT0_TX0N) ; off-sheet PCIE30_PORT0_TX0N
PCIE30_PORT0_TX0P: U1000.D32(PCIE30_PORT0_TX0P) ; off-sheet PCIE30_PORT0_TX0P
PCIE30_PORT0_TX1N: U1000.C34(PCIE30_PORT0_TX1N) ; off-sheet PCIE30_PORT0_TX1N
PCIE30_PORT0_TX1P: U1000.C33(PCIE30_PORT0_TX1P) ; off-sheet PCIE30_PORT0_TX1P
PCIE30_PORT1_REFCLKN_IN: U1000.B28(PCIE30_PORT1_REF_CLKN) ; off-sheet PCIE30_PORT1_REFCLKN_IN
PCIE30_PORT1_REFCLKP_IN: U1000.A28(PCIE30_PORT1_REF_CLKP) ; off-sheet PCIE30_PORT1_REFCLKP_IN
PCIE30_PORT1_RX2N: U1000.A32(PCIE30_PORT1_RX0N) ; off-sheet PCIE30_PORT1_RX2N
PCIE30_PORT1_RX2P: U1000.B32(PCIE30_PORT1_RX0P) ; off-sheet PCIE30_PORT1_RX2P
PCIE30_PORT1_RX3N: U1000.B31(PCIE30_PORT1_RX1N) ; off-sheet PCIE30_PORT1_RX3N
PCIE30_PORT1_RX3P: U1000.C31(PCIE30_PORT1_RX1P) ; off-sheet PCIE30_PORT1_RX3P
PCIE30_PORT1_TX2N: U1000.A30(PCIE30_PORT1_TX0N) ; off-sheet PCIE30_PORT1_TX2N
PCIE30_PORT1_TX2P: U1000.B30(PCIE30_PORT1_TX0P) ; off-sheet PCIE30_PORT1_TX2P
PCIE30_PORT1_TX3N: U1000.B29(PCIE30_PORT1_TX1N) ; off-sheet PCIE30_PORT1_TX3N
PCIE30_PORT1_TX3P: U1000.C29(PCIE30_PORT1_TX1P) ; off-sheet PCIE30_PORT1_TX3P
SATA30_0_RXN: U1000.N34(PCIE20_0_RXN/SATA30_0_RXN) ; off-sheet SATA30_0_RXN
SATA30_0_RXP: U1000.N33(PCIE20_0_RXP/SATA30_0_RXP) ; off-sheet SATA30_0_RXP
SATA30_0_TXN: U1000.M33(PCIE20_0_TXN/SATA30_0_TXN) ; off-sheet SATA30_0_TXN
SATA30_0_TXP: U1000.M34(PCIE20_0_TXP/SATA30_0_TXP) ; off-sheet SATA30_0_TXP
SATA30_1_RXN: U1000.J34(PCIE20_1_RXN/SATA30_1_RXN) ; off-sheet SATA30_1_RXN
SATA30_1_RXP: U1000.J33(PCIE20_1_RXP/SATA30_1_RXP) ; off-sheet SATA30_1_RXP
SATA30_1_TXN: U1000.K34(PCIE20_1_TXN/SATA30_1_TXN) ; off-sheet SATA30_1_TXN
SATA30_1_TXP: U1000.K33(PCIE20_1_TXP/SATA30_1_TXP) ; off-sheet SATA30_1_TXP
USB30_2_SSRXN: U1000.J30(PCIE20_2_RXN/SATA30_2_RXN/USB30_2_SSRXN) ; off-sheet USB30_2_SSRXN
USB30_2_SSRXP: U1000.J31(PCIE20_2_RXP/SATA30_2_RXP/USB30_2_SSRXP) ; off-sheet USB30_2_SSRXP
USB30_2_SSTXN: U1000.H29(PCIE20_2_TXN/SATA30_2_TXN/USB30_2_SSTXN) ; off-sheet USB30_2_SSTXN
USB30_2_SSTXP: U1000.H30(PCIE20_2_TXP/SATA30_2_TXP/USB30_2_SSTXP) ; off-sheet USB30_2_SSTXP

Not connected (* = marked no-connect by the designer): U1000 G30(PCIE20_2_REFCLKN)* G31(PCIE20_2_REFCLKP)* H32(PCIE20_1_REFCLKP)* H33(PCIE20_1_REFCLKN)* L32(PCIE20_0_REFCLKP)* L33(PCIE20_0_REFCLKN)*

### Notes on the sheet
- RK3588_N(PCIE20)
- CLK Differential Pair:
  100 OhmЎА10%
- RK3588_O(PCIE30)
- Note:
- If not used,
  Signal:leave floating
  Power: Tie to VSS
- DATA Differential Pair:
  PCIE20:   85 Ohm ЎА10%
  SATA30: 100 Ohm ЎА10%
- Only PCIE30 Controller 0
  support RC and EP,Other
  controller only support RC
  Mode.
- Diff 100 Ohm ЎА10%
- Diff 85 Ohm ЎА10%
- Power merging,
  capacitance sharing
- Diff 90 Ohm ЎА10%
- If Port0 and Port1 are not used,
  Port0 and Port1 REF_CLKP/N:   Leave floating or tie to VSS
  Port0 and Port1 Other Signal: Leave floating
  Port0 and Port1 Power:        Leave floating or tie to VSS
- If Port0 is used ,Port1 is not used,
  Port1 REF_CLKP/N:   Leave floating or tie to VSS
  Port1 Other Signal: Leave floating
  Port1 Power:        Must supply power
- If Port1 is used ,Port0 is not used,
  Port0 REF_CLKP/N:   Leave floating or tie to VSS
  Port0 Other Signal: Leave floating
  Port0 Power:        Must supply power
- Caps of between dashed green lines and U1000
  should be placed under the U1000 package.
  Other caps should be placed close to the U1000 package
- (in symbol SOC_RK3588, part N) PCIE20/SATA30 Mux0; input or output; PCIe20x1_2 / 1Lane(RC)--4(1L2); MUX; SATA30 HOST / Controller0; PCIE20:Gen1/Gen2 / SATA30:Gen1/Gen2/Gen3; PCIE20/SATA30 Mux1; PCIe30x1_0 / 1Lane(RC)--2(1L0); SATA30 HOST / Controller1; PCIE20/SATA30/USB30 HOST Mux2; PCIe30x1_1 / 1Lane(RC)--3(1L1); SATA30 HOST / Controller2; USB30 HOST / Controller2; PCIE20:Gen1/Gen2 / USB 30:Gen1 / SATA30:Gen1/Gen2/Gen3
- (in symbol SOC_RK3588, part O) PCIE30 PORT0 /; PCIE30X4; input; Lane0 /; PCIe30X4 / 4Lane(DM)--0(4L); Lane1 /; PCIe30x1_0 / 1Lane(RC)--2(1L0); PCIE20/SATA30 / MUX1; PCIE30: / PCIe1.1(2.5Gbps) / PCIe2.1(5Gbps) / PCIe3.0(8Gbps) /; PCIE30 PORT1 /; Lane0; PCIe30x2 / 2Lane(RC)--1(2L); PCIe30x1_1 / 1Lane(RC)--3(1L1); PCIE20/SATA30/USB30 / MUX2

### Library data of the parts
C1801 = CAP NP: cap,10.00uF,+/-20%,4V,X5R,C0402; Part Reference: C1801; Manufacturer PN: CC0402MRX5R4BB106; Manufacturer: YAGEO; Value: 10uF; Tolerance: 20%; Priority: A; PCB Footprint: C0402_BGA; Created by: JJJ; Part Type: C0402; RK PN: CC0402MRX5R4BB106
C1803 = CAP NP: cap,4.70uF,+/-10%,6.3V,X5R,C0402; Part Reference: C1803; Manufacturer PN: C1005X5R0J475K050BC; Manufacturer: TDK; Value: 4.7uF; Tolerance: 10%; Priority: A; PCB Footprint: C0402_BGA; Created by: JJJ; Part Type: C0402; RK PN: C1005X5R0J475K050BC
C1804 = CAP NP: cap,1.00uF,+/-20%,6.3V,X5R,C0201; Part Reference: C1804; Manufacturer: TDK; Value: 1uF; RK PN: C0603X5R0J105M030BC; Priority: A; Tolerance: 20%; PCB Footprint: C0201; Part Type: C0201; Manufacturer PN: C0603X5R0J105M030BC; Created by: JJJ
C1805 = CAP NP: cap,4.70uF,+/-10%,6.3V,X5R,C0402; Part Reference: C1805; Manufacturer PN: C1005X5R0J475K050BC; Manufacturer: TDK; Value: 4.7uF; Tolerance: 10%; Priority: A; PCB Footprint: C0402_BGA; Created by: JJJ; Part Type: C0402; RK PN: C1005X5R0J475K050BC
C1806 = CAP NP: cap,1.00uF,+/-20%,6.3V,X5R,C0201; Part Reference: C1806; Manufacturer PN: C0603X5R0J105M030BC; Manufacturer: TDK; Value: 1uF; Tolerance: 20%; Priority: A; PCB Footprint: C0201; Created by: JJJ; Part Type: C0201; RK PN: C0603X5R0J105M030BC
C1807 = CAP NP: cap,4.70uF,+/-10%,6.3V,X5R,C0402; Part Reference: C1807; Manufacturer PN: C1005X5R0J475K050BC; Manufacturer: TDK; Value: 4.7uF; Tolerance: 10%; Priority: A; PCB Footprint: C0402_BGA; Created by: JJJ; Part Type: C0402; RK PN: C1005X5R0J475K050BC
C1808 = CAP NP: cap,100.00nF,+/-10%,10V,X5R,C0201; Part Reference: C1808; Manufacturer PN: C0603X5R1A104K030BC; Manufacturer: TDK; Value: 100nF; Tolerance: 10%; Priority: A; PCB Footprint: C0201; Created by: JJJ; Part Type: C0201; RK PN: C0603X5R1A104K030BC
C1810 = CAP NP: cap,100.00nF,+/-10%,10V,X5R,C0201; Part Reference: C1810; Manufacturer: TDK; Value: 100nF; RK PN: C0603X5R1A104K030BC; Priority: A; Tolerance: 10%; PCB Footprint: C0201; Part Type: C0201; Manufacturer PN: C0603X5R1A104K030BC; Created by: JJJ
C1812 = CAP NP: cap,1.00uF,+/-20%,6.3V,X5R,C0201; Part Reference: C1812; Manufacturer: TDK; Value: 1uF; RK PN: C0603X5R0J105M030BC; Priority: A; Tolerance: 20%; PCB Footprint: C0201; Part Type: C0201; Manufacturer PN: C0603X5R0J105M030BC; Created by: JJJ
C1813 = CAP NP: cap,4.70uF,+/-10%,6.3V,X5R,C0402; Part Reference: C1813; Manufacturer PN: C1005X5R0J475K050BC; Manufacturer: TDK; Value: 4.7uF; Tolerance: 10%; Priority: A; PCB Footprint: C0402_BGA; Created by: JJJ; Part Type: C0402; RK PN: C1005X5R0J475K050BC
C1814 = CAP NP: cap,100.00nF,+/-10%,10V,X5R,C0201; Part Reference: C1814; Manufacturer PN: C0603X5R1A104K030BC; Manufacturer: TDK; Value: 100nF; Tolerance: 10%; Priority: A; PCB Footprint: C0201; Created by: JJJ; Part Type: C0201; RK PN: C0603X5R1A104K030BC
C1815 = CAP NP: cap,4.70uF,+/-10%,6.3V,X5R,C0402; Part Reference: C1815; Manufacturer PN: C1005X5R0J475K050BC; Manufacturer: TDK; Value: 4.7uF; Tolerance: 10%; Priority: A; PCB Footprint: C0402_BGA; Created by: JJJ; Part Type: C0402; RK PN: C1005X5R0J475K050BC
C1816 = CAP NP: cap,1.00uF,+/-20%,6.3V,X5R,C0201; Part Reference: C1816; Manufacturer PN: C0603X5R0J105M030BC; Manufacturer: TDK; Value: 1uF; Tolerance: 20%; Priority: A; PCB Footprint: C0201; Created by: JJJ; Part Type: C0201; RK PN: C0603X5R0J105M030BC
C1819 = CAP NP: cap,4.70uF,+/-10%,6.3V,X5R,C0402; Part Reference: C1819; Manufacturer PN: C1005X5R0J475K050BC; Manufacturer: TDK; Value: 4.7uF; Tolerance: 10%; Priority: A; PCB Footprint: C0402_BGA; Created by: JJJ; Part Type: C0402; RK PN: C1005X5R0J475K050BC
R1800 = RESISTOR_Dup1: НЁУГєсД¤µзЧи,200R,+/-1%,R0201,1/20W.; Part Reference: R1800; Manufacturer PN: RC0201FR-07200RL; Manufacturer: YAGEO; Wattage: 1/20W; Priority: A; Value: 200R; Created by: YTL; Part Type: НЁУГєсД¤µзЧи; RK PN: RC0201FR-07200RL
R1801 = RESISTOR_Dup1: НЁУГєсД¤µзЧи,200R,+/-1%,R0201,1/20W.; Part Reference: R1801; Manufacturer PN: RC0201FR-07200RL; Manufacturer: YAGEO; Wattage: 1/20W; Priority: A; Value: 200R; Created by: YTL; Part Type: НЁУГєсД¤µзЧи; RK PN: RC0201FR-07200RL
U1000 = SOC_RK3588: ROCKCHIP SOC; Part Reference: U1000; Manufacturer: Rockchip (ИрРѕОў); SPLIT_INST: TRUE; SWAP_INFO: (S1+S2+S3+S4+S5+S6+S7+S8+S9+S10+S11+S12+S13+S14+S15+S16+S17+S18+S19+S20+S21+S22+S23+S24+S25+S26); Value: RK3588; Priority: A; RK PN: RK3588; Part Type: SOC; Manufacturer PN: RK3588; Created by: YWQ; PCB Footprint: BGA1088_23R00X23R00X2R00

## Sheet 19.RK3588_1.8V_ 3.3V GPIO.SchDoc
size 594 x 420 mm; Revision: V2.1; Schematic Page Number: 11; Page Number: 19; Check: <Checker>; Schematic Name: RK_NVR_DEMO1_RK3588_LP4/4x_V21; Page Count: 43; Page name: 19.RK3588_1.8V/ 3.3V GPIO; Designer: Zhangdz; Schematic Page Count: 99; Revcode: V2.1; DsnPath: E:\Work\SBER\RK3588_SOM\temp\RK_NVR_DEMO1_RK3588_LP4XD200P232SD8_V21_20211228.DSN; SchematicName: RK_NVR_DEMO1_RK3588_LP4/4x_V21; PageName: 19.RK3588_1.8V/ 3.3V GPIO; PageSize: A2; TopSchematic: True
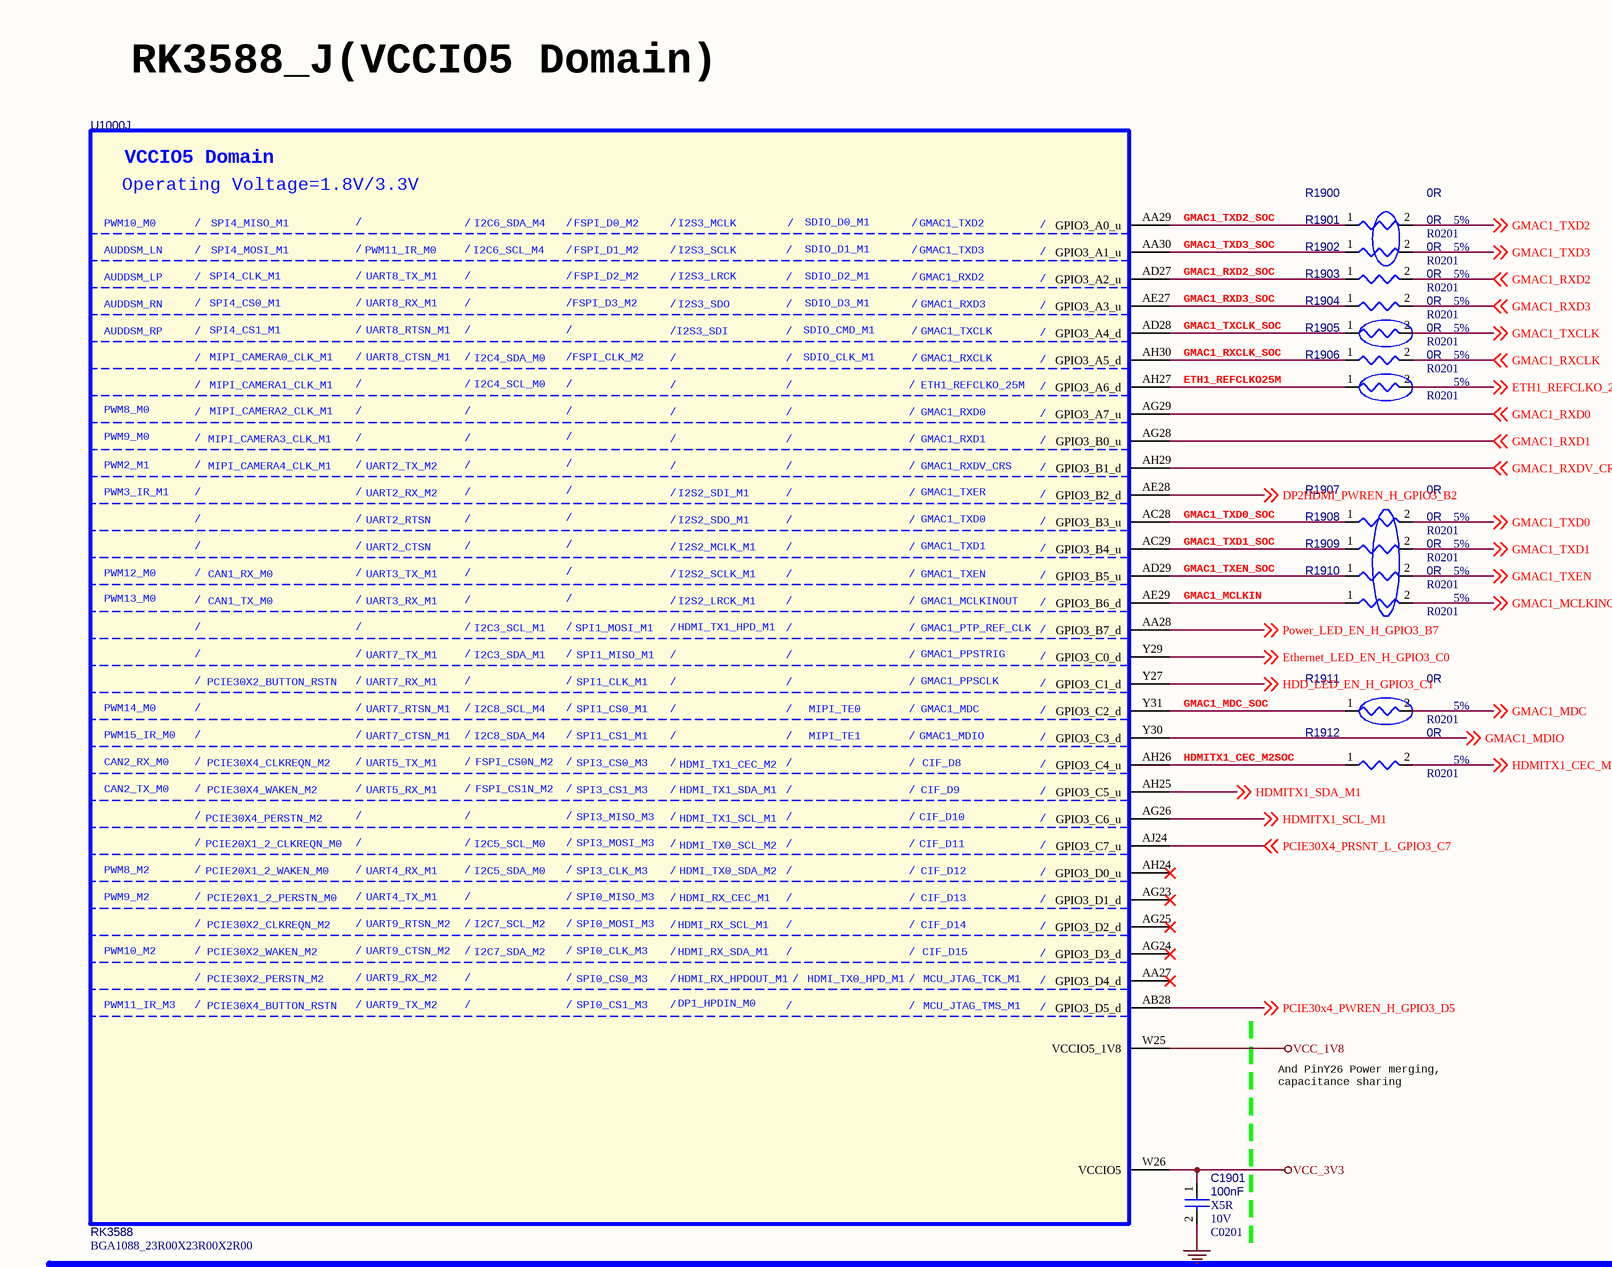
[diagram p34: 19.RK3588_1.8V_ 3.3V GPIO.SchDoc, top left]
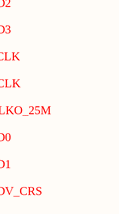
[diagram p35: 19.RK3588_1.8V_ 3.3V GPIO.SchDoc, top right]
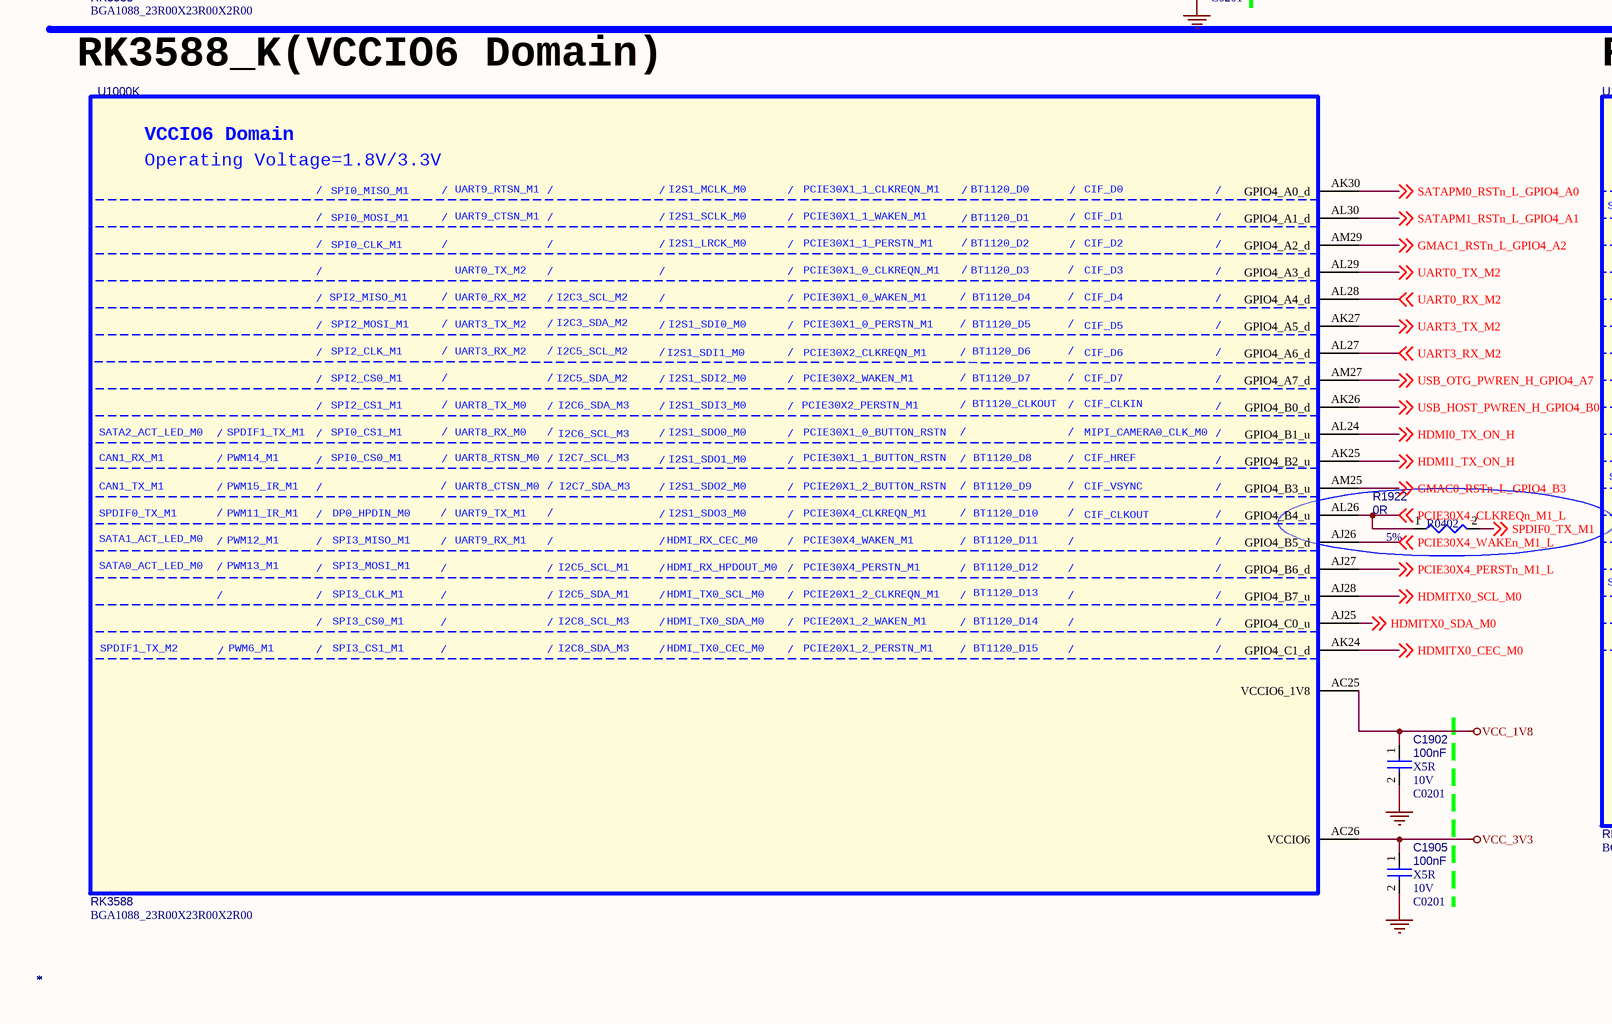
[diagram p36: 19.RK3588_1.8V_ 3.3V GPIO.SchDoc, bottom left]
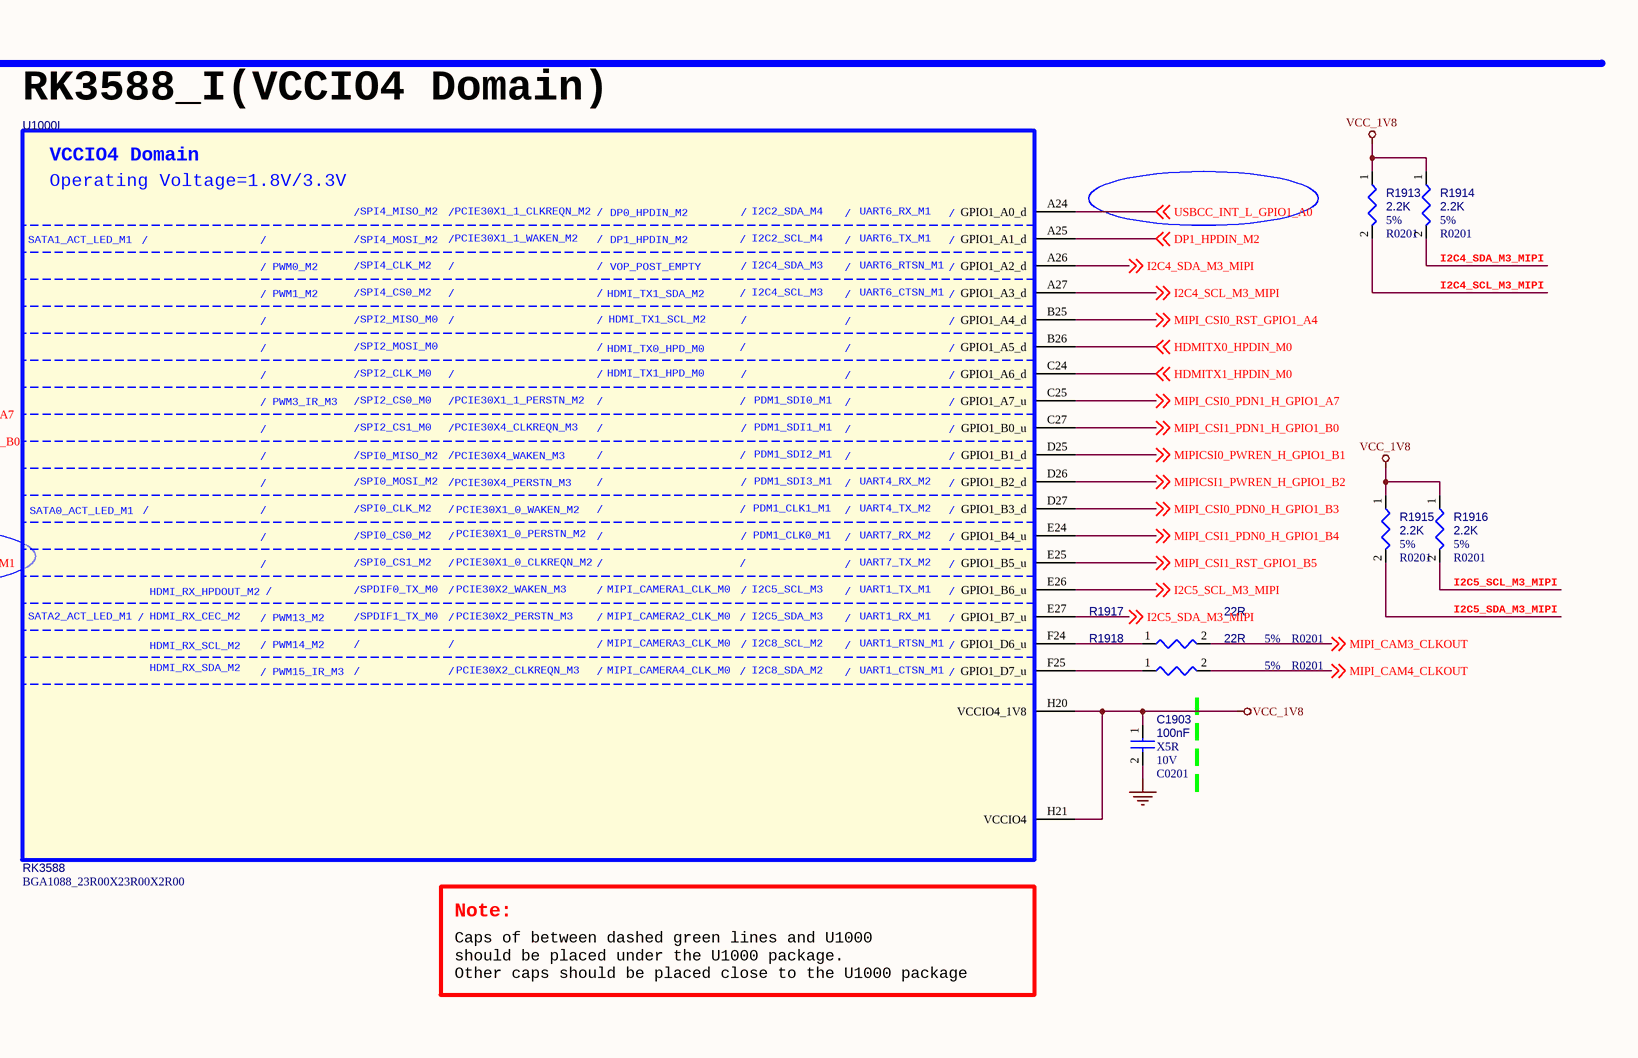
[diagram p37: 19.RK3588_1.8V_ 3.3V GPIO.SchDoc, bottom right]

### Parts
C1901  *  Voltage: 10V  Dielectric: X5R  [C0201]
C1902  *  Voltage: 10V  Dielectric: X5R  [C0201]
C1903  *  Voltage: 10V  Dielectric: X5R  [C0201]
C1905  *  Voltage: 10V  Dielectric: X5R  [C0201]
R1900  *  PCB Footprint: R0201  Tolerance: 5%  [R0402]
R1901  *  PCB Footprint: R0201  Tolerance: 5%  [R0402]
R1902  *  PCB Footprint: R0201  Tolerance: 5%  [R0402]
R1903  *  PCB Footprint: R0201  Tolerance: 5%  [R0402]
R1904  *  PCB Footprint: R0201  Tolerance: 5%  [R0402]
R1905  *  PCB Footprint: R0201  Tolerance: 5%  [R0402]
R1906  *  PCB Footprint: R0201  Tolerance: 5%  [R0402]
R1907  *  PCB Footprint: R0201  Tolerance: 5%  [R0402]
R1908  *  PCB Footprint: R0201  Tolerance: 5%  [R0402]
R1909  *  PCB Footprint: R0201  Tolerance: 5%  [R0402]
R1910  *  PCB Footprint: R0201  Tolerance: 5%  [R0402]
R1911  *  PCB Footprint: R0201  Tolerance: 5%  [R0402]
R1912  *  PCB Footprint: R0201  Tolerance: 5%  [R0402]
R1913  *  PCB Footprint: R0201  Tolerance: 5%  [R0402]
R1914  *  PCB Footprint: R0201  Tolerance: 5%  [R0402]
R1915  *  PCB Footprint: R0201  Tolerance: 5%  [R0402]
R1916  *  PCB Footprint: R0201  Tolerance: 5%  [R0402]
R1917  *  PCB Footprint: R0201  Tolerance: 5%  [R0402]
R1918  *  PCB Footprint: R0201  Tolerance: 5%  [R0402]
R1922  *  Tolerance: 5%  [R0402]
U1000  *  [BGA1088_23R00X23R00X2R00]  (parts I,J,K of 26)

### Nets
GND: C1901.2 C1902.2 C1903.2 C1905.2
VCC_1V8: C1902.1 C1903.1 R1913.1 R1914.1 R1915.1 R1916.1 U1000.AC25(VCCIO6_1V8) U1000.H20(VCCIO4_1V8) U1000.H21(VCCIO4) U1000.W25(VCCIO5_1V8)
VCC_3V3: C1901.1 C1905.1 U1000.AC26(VCCIO6) U1000.W26(VCCIO5)
DP1_HPDIN_M2: U1000.A25(GPIO1_A1_d) ; off-sheet DP1_HPDIN_M2
DP2HDMI_PWREN_H_GPIO3_B2: U1000.AE28(GPIO3_B2_d) ; off-sheet DP2HDMI_PWREN_H_GPIO3_B2
ETH1_REFCLKO25M: R1906.1 U1000.AH27(GPIO3_A6_d)
ETH1_REFCLKO_25M: R1906.2 ; off-sheet ETH1_REFCLKO_25M
Ethernet_LED_EN_H_GPIO3_C0: U1000.Y29(GPIO3_C0_d) ; off-sheet Ethernet_LED_EN_H_GPIO3_C0
GMAC0_RSTn_L_GPIO4_B3: U1000.AM25(GPIO4_B3_u) ; off-sheet GMAC0_RSTn_L_GPIO4_B3
GMAC1_MCLKIN: R1910.1 U1000.AE29(GPIO3_B6_d)
GMAC1_MCLKINOUT: R1910.2 ; off-sheet GMAC1_MCLKINOUT
GMAC1_MDC: R1911.2 ; off-sheet GMAC1_MDC
GMAC1_MDC_SOC: R1911.1 U1000.Y31(GPIO3_C2_d)
GMAC1_MDIO: U1000.Y30(GPIO3_C3_d) ; off-sheet GMAC1_MDIO
GMAC1_RSTn_L_GPIO4_A2: U1000.AM29(GPIO4_A2_d) ; off-sheet GMAC1_RSTn_L_GPIO4_A2
GMAC1_RXCLK: R1905.2 ; off-sheet GMAC1_RXCLK
GMAC1_RXCLK_SOC: R1905.1 U1000.AH30(GPIO3_A5_d)
GMAC1_RXD0: U1000.AG29(GPIO3_A7_u) ; off-sheet GMAC1_RXD0
GMAC1_RXD1: U1000.AG28(GPIO3_B0_u) ; off-sheet GMAC1_RXD1
GMAC1_RXD2: R1902.2 ; off-sheet GMAC1_RXD2
GMAC1_RXD2_SOC: R1902.1 U1000.AD27(GPIO3_A2_u)
GMAC1_RXD3: R1903.2 ; off-sheet GMAC1_RXD3
GMAC1_RXD3_SOC: R1903.1 U1000.AE27(GPIO3_A3_u)
GMAC1_RXDV_CRS: U1000.AH29(GPIO3_B1_d) ; off-sheet GMAC1_RXDV_CRS
GMAC1_TXCLK: R1904.2 ; off-sheet GMAC1_TXCLK
GMAC1_TXCLK_SOC: R1904.1 U1000.AD28(GPIO3_A4_d)
GMAC1_TXD0: R1907.2 ; off-sheet GMAC1_TXD0
GMAC1_TXD0_SOC: R1907.1 U1000.AC28(GPIO3_B3_u)
GMAC1_TXD1: R1908.2 ; off-sheet GMAC1_TXD1
GMAC1_TXD1_SOC: R1908.1 U1000.AC29(GPIO3_B4_u)
GMAC1_TXD2: R1900.2 ; off-sheet GMAC1_TXD2
GMAC1_TXD2_SOC: R1900.1 U1000.AA29(GPIO3_A0_u)
GMAC1_TXD3: R1901.2 ; off-sheet GMAC1_TXD3
GMAC1_TXD3_SOC: R1901.1 U1000.AA30(GPIO3_A1_u)
GMAC1_TXEN: R1909.2 ; off-sheet GMAC1_TXEN
GMAC1_TXEN_SOC: R1909.1 U1000.AD29(GPIO3_B5_u)
HDD_LED_EN_H_GPIO3_C1: U1000.Y27(GPIO3_C1_d) ; off-sheet HDD_LED_EN_H_GPIO3_C1
HDMI0_TX_ON_H: U1000.AL24(GPIO4_B1_u) ; off-sheet HDMI0_TX_ON_H
HDMI1_TX_ON_H: U1000.AK25(GPIO4_B2_u) ; off-sheet HDMI1_TX_ON_H
HDMITX0_CEC_M0: U1000.AK24(GPIO4_C1_d) ; off-sheet HDMITX0_CEC_M0
HDMITX0_HPDIN_M0: U1000.B26(GPIO1_A5_d) ; off-sheet HDMITX0_HPDIN_M0
HDMITX0_SCL_M0: U1000.AJ28(GPIO4_B7_u) ; off-sheet HDMITX0_SCL_M0
HDMITX0_SDA_M0: U1000.AJ25(GPIO4_C0_u) ; off-sheet HDMITX0_SDA_M0
HDMITX1_CEC_M2: R1912.2 ; off-sheet HDMITX1_CEC_M2
HDMITX1_CEC_M2SOC: R1912.1 U1000.AH26(GPIO3_C4_u)
HDMITX1_HPDIN_M0: U1000.C24(GPIO1_A6_d) ; off-sheet HDMITX1_HPDIN_M0
HDMITX1_SCL_M1: U1000.AG26(GPIO3_C6_u) ; off-sheet HDMITX1_SCL_M1
HDMITX1_SDA_M1: U1000.AH25(GPIO3_C5_u) ; off-sheet HDMITX1_SDA_M1
I2C4_SCL_M3_MIPI: R1913.2 U1000.A27(GPIO1_A3_d) ; off-sheet I2C4_SCL_M3_MIPI
I2C4_SDA_M3_MIPI: R1914.2 U1000.A26(GPIO1_A2_d) ; off-sheet I2C4_SDA_M3_MIPI
I2C5_SCL_M3_MIPI: R1916.2 U1000.E26(GPIO1_B6_u) ; off-sheet I2C5_SCL_M3_MIPI
I2C5_SDA_M3_MIPI: R1915.2 U1000.E27(GPIO1_B7_u) ; off-sheet I2C5_SDA_M3_MIPI
MIPI_CAM3_CLKOUT: R1917.2 ; off-sheet MIPI_CAM3_CLKOUT
MIPI_CAM4_CLKOUT: R1918.2 ; off-sheet MIPI_CAM4_CLKOUT
MIPI_CSI0_PDN0_H_GPIO1_B3: U1000.D27(GPIO1_B3_d) ; off-sheet MIPI_CSI0_PDN0_H_GPIO1_B3
MIPI_CSI0_PDN1_H_GPIO1_A7: U1000.C25(GPIO1_A7_u) ; off-sheet MIPI_CSI0_PDN1_H_GPIO1_A7
MIPI_CSI0_RST_GPIO1_A4: U1000.B25(GPIO1_A4_d) ; off-sheet MIPI_CSI0_RST_GPIO1_A4
MIPI_CSI1_PDN0_H_GPIO1_B4: U1000.E24(GPIO1_B4_u) ; off-sheet MIPI_CSI1_PDN0_H_GPIO1_B4
MIPI_CSI1_PDN1_H_GPIO1_B0: U1000.C27(GPIO1_B0_u) ; off-sheet MIPI_CSI1_PDN1_H_GPIO1_B0
MIPI_CSI1_RST_GPIO1_B5: U1000.E25(GPIO1_B5_u) ; off-sheet MIPI_CSI1_RST_GPIO1_B5
MIPICSI0_PWREN_H_GPIO1_B1: U1000.D25(GPIO1_B1_d) ; off-sheet MIPICSI0_PWREN_H_GPIO1_B1
MIPICSI1_PWREN_H_GPIO1_B2: U1000.D26(GPIO1_B2_d) ; off-sheet MIPICSI1_PWREN_H_GPIO1_B2
PCIE30X4_CLKREQn_M1_L: R1922.1 U1000.AL26(GPIO4_B4_u) ; off-sheet PCIE30X4_CLKREQn_M1_L
PCIE30X4_PERSTn_M1_L: U1000.AJ27(GPIO4_B6_d) ; off-sheet PCIE30X4_PERSTn_M1_L
PCIE30X4_PRSNT_L_GPIO3_C7: U1000.AJ24(GPIO3_C7_u) ; off-sheet PCIE30X4_PRSNT_L_GPIO3_C7
PCIE30x4_PWREN_H_GPIO3_D5: U1000.AB28(GPIO3_D5_d) ; off-sheet PCIE30x4_PWREN_H_GPIO3_D5
PCIE30X4_WAKEn_M1_L: U1000.AJ26(GPIO4_B5_d) ; off-sheet PCIE30X4_WAKEn_M1_L
Power_LED_EN_H_GPIO3_B7: U1000.AA28(GPIO3_B7_d) ; off-sheet Power_LED_EN_H_GPIO3_B7
SATAPM0_RSTn_L_GPIO4_A0: U1000.AK30(GPIO4_A0_d) ; off-sheet SATAPM0_RSTn_L_GPIO4_A0
SATAPM1_RSTn_L_GPIO4_A1: U1000.AL30(GPIO4_A1_d) ; off-sheet SATAPM1_RSTn_L_GPIO4_A1
SPDIF0_TX_M1: R1922.2 ; off-sheet SPDIF0_TX_M1
UART0_RX_M2: U1000.AL28(GPIO4_A4_d) ; off-sheet UART0_RX_M2
UART0_TX_M2: U1000.AL29(GPIO4_A3_d) ; off-sheet UART0_TX_M2
UART3_RX_M2: U1000.AL27(GPIO4_A6_d) ; off-sheet UART3_RX_M2
UART3_TX_M2: U1000.AK27(GPIO4_A5_d) ; off-sheet UART3_TX_M2
USB_HOST_PWREN_H_GPIO4_B0: U1000.AK26(GPIO4_B0_d) ; off-sheet USB_HOST_PWREN_H_GPIO4_B0
USB_OTG_PWREN_H_GPIO4_A7: U1000.AM27(GPIO4_A7_d) ; off-sheet USB_OTG_PWREN_H_GPIO4_A7
USBCC_INT_L_GPIO1_A0: U1000.A24(GPIO1_A0_d) ; off-sheet USBCC_INT_L_GPIO1_A0
NetR1917_1: R1917.1 U1000.F24(GPIO1_D6_u)
NetR1918_1: R1918.1 U1000.F25(GPIO1_D7_u)

Not connected (* = marked no-connect by the designer): U1000 AA27(GPIO3_D4_d)* AG23(GPIO3_D1_d)* AG24(GPIO3_D3_d)* AG25(GPIO3_D2_d)* AH24(GPIO3_D0_u)*

### Notes on the sheet
- RK3588_J(VCCIO5 Domain)
- And PinY26 Power merging,
  capacitance sharing
- RK3588_K(VCCIO6 Domain)
- RK3588_I(VCCIO4 Domain)
- Caps of between dashed green lines and U1000
  should be placed under the U1000 package.
  Other caps should be placed close to the U1000 package
- Note:
- (in symbol SOC_RK3588, part I) VCCIO4 Domain; Operating Voltage=1.8V/3.3V; /; SPI4_MISO_M2; PCIE30X1_1_CLKREQN_M2; DP0_HPDIN_M2; I2C2_SDA_M4; UART6_RX_M1; SATA1_ACT_LED_M1; SPI4_MOSI_M2; PCIE30X1_1_WAKEN_M2; DP1_HPDIN_M2; I2C2_SCL_M4; UART6_TX_M1; PWM0_M2; SPI4_CLK_M2; VOP_POST_EMPTY; I2C4_SDA_M3; UART6_RTSN_M1; PWM1_M2; SPI4_CS0_M2; HDMI_TX1_SDA_M2; I2C4_SCL_M3; UART6_CTSN_M1; SPI2_MISO_M0; HDMI_TX1_SCL_M2; SPI2_MOSI_M0; HDMI_TX0_HPD_M0; SPI2_CLK_M0; HDMI_TX1_HPD_M0; PWM3_IR_M3; SPI2_CS0_M0; PCIE30X1_1_PERSTN_M2; PDM1_SDI0_M1; SPI2_CS1_M0; PCIE30X4_CLKREQN_M3; PDM1_SDI1_M1; SPI0_MISO_M2; PCIE30X4_WAKEN_M3; PDM1_SDI2_M1; SPI0_MOSI_M2; PCIE30X4_PERSTN_M3; PDM1_SDI3_M1; UART4_RX_M2; SATA0_ACT_LED_M1; SPI0_CLK_M2; PCIE30X1_0_WAKEN_M2; PDM1_CLK1_M1; UART4_TX_M2; SPI0_CS0_M2; PCIE30X1_0_PERSTN_M2; PDM1_CLK0_M1; UART7_RX_M2; SPI0_CS1_M2; PCIE30X1_0_CLKREQN_M2; UART7_TX_M2; HDMI_RX_HPDOUT_M2; SPDIF0_TX_M0; PCIE30X2_WAKEN_M3; MIPI_CAMERA1_CLK_M0; I2C5_SCL_M3; UART1_TX_M1; SATA2_ACT_LED_M1; HDMI_RX_CEC_M2; PWM13_M2; SPDIF1_TX_M0; PCIE30X2_PERSTN_M3; MIPI_CAMERA2_CLK_M0; I2C5_SDA_M3; UART1_RX_M1; HDMI_RX_SCL_M2; PWM14_M2; MIPI_CAMERA3_CLK_M0; I2C8_SCL_M2; UART1_RTSN_M1; HDMI_RX_SDA_M2; PWM15_IR_M3; PCIE30X2_CLKREQN_M3; MIPI_CAMERA4_CLK_M0; I2C8_SDA_M2; UART1_CTSN_M1
- (in symbol SOC_RK3588, part J) VCCIO5 Domain; Operating Voltage=1.8V/3.3V; PWM10_M0; /; SPI4_MISO_M1; I2C6_SDA_M4; FSPI_D0_M2; I2S3_MCLK; SDIO_D0_M1; GMAC1_TXD2; AUDDSM_LN; SPI4_MOSI_M1; PWM11_IR_M0; I2C6_SCL_M4; FSPI_D1_M2; I2S3_SCLK; SDIO_D1_M1; GMAC1_TXD3; AUDDSM_LP; SPI4_CLK_M1; UART8_TX_M1; FSPI_D2_M2; I2S3_LRCK; SDIO_D2_M1; GMAC1_RXD2; AUDDSM_RN; SPI4_CS0_M1; UART8_RX_M1; FSPI_D3_M2; I2S3_SDO; SDIO_D3_M1; GMAC1_RXD3; AUDDSM_RP; SPI4_CS1_M1; UART8_RTSN_M1; I2S3_SDI; SDIO_CMD_M1; GMAC1_TXCLK; MIPI_CAMERA0_CLK_M1; UART8_CTSN_M1; I2C4_SDA_M0; FSPI_CLK_M2; SDIO_CLK_M1; GMAC1_RXCLK; MIPI_CAMERA1_CLK_M1; I2C4_SCL_M0; ETH1_REFCLKO_25M; PWM8_M0; MIPI_CAMERA2_CLK_M1; GMAC1_RXD0; PWM9_M0; MIPI_CAMERA3_CLK_M1; GMAC1_RXD1; PWM2_M1; MIPI_CAMERA4_CLK_M1; UART2_TX_M2; GMAC1_RXDV_CRS; PWM3_IR_M1; UART2_RX_M2; I2S2_SDI_M1; GMAC1_TXER; UART2_RTSN; I2S2_SDO_M1; GMAC1_TXD0; UART2_CTSN; I2S2_MCLK_M1; GMAC1_TXD1; PWM12_M0; CAN1_RX_M0; UART3_TX_M1; I2S2_SCLK_M1; GMAC1_TXEN; PWM13_M0; CAN1_TX_M0; UART3_RX_M1; I2S2_LRCK_M1; GMAC1_MCLKINOUT; I2C3_SCL_M1; SPI1_MOSI_M1; HDMI_TX1_HPD_M1; GMAC1_PTP_REF_CLK; UART7_TX_M1; I2C3_SDA_M1; SPI1_MISO_M1; GMAC1_PPSTRIG; PCIE30X2_BUTTON_RSTN; UART7_RX_M1; SPI1_CLK_M1; GMAC1_PPSCLK; PWM14_M0; UART7_RTSN_M1; I2C8_SCL_M4; SPI1_CS0_M1; MIPI_TE0; GMAC1_MDC; PWM15_IR_M0; UART7_CTSN_M1; I2C8_SDA_M4; SPI1_CS1_M1; MIPI_TE1; GMAC1_MDIO; CAN2_RX_M0; PCIE30X4_CLKREQN_M2; UART5_TX_M1; FSPI_CS0N_M2; SPI3_CS0_M3; HDMI_TX1_CEC_M2; CIF_D8; CAN2_TX_M0; PCIE30X4_WAKEN_M2; UART5_RX_M1; FSPI_CS1N_M2; SPI3_CS1_M3; HDMI_TX1_SDA_M1; CIF_D9; PCIE30X4_PERSTN_M2; SPI3_MISO_M3; HDMI_TX1_SCL_M1; CIF_D10; PCIE20X1_2_CLKREQN_M0; I2C5_SCL_M0; SPI3_MOSI_M3; HDMI_TX0_SCL_M2; CIF_D11; PWM8_M2; PCIE20X1_2_WAKEN_M0; UART4_RX_M1; I2C5_SDA_M0; SPI3_CLK_M3; HDMI_TX0_SDA_M2; CIF_D12; PWM9_M2; PCIE20X1_2_PERSTN_M0; UART4_TX_M1; SPI0_MISO_M3; HDMI_RX_CEC_M1; CIF_D13; PCIE30X2_CLKREQN_M2; UART9_RTSN_M2; I2C7_SCL_M2; SPI0_MOSI_M3; HDMI_RX_SCL_M1; CIF_D14; PWM10_M2; PCIE30X2_WAKEN_M2; UART9_CTSN_M2; I2C7_SDA_M2; SPI0_CLK_M3; HDMI_RX_SDA_M1; CIF_D15; PCIE30X2_PERSTN_M2; UART9_RX_M2; SPI0_CS0_M3; HDMI_RX_HPDOUT_M1; HDMI_TX0_HPD_M1; MCU_JTAG_TCK_M1; DP1_HPDIN_M0; PWM11_IR_M3; PCIE30X4_BUTTON_RSTN; UART9_TX_M2; SPI0_CS1_M3; MCU_JTAG_TMS_M1
- (in symbol SOC_RK3588, part K) VCCIO6 Domain; Operating Voltage=1.8V/3.3V; /; SPI0_MISO_M1; UART9_RTSN_M1; I2S1_MCLK_M0; PCIE30X1_1_CLKREQN_M1; BT1120_D0; CIF_D0; SPI0_MOSI_M1; UART9_CTSN_M1; I2S1_SCLK_M0; PCIE30X1_1_WAKEN_M1; BT1120_D1; CIF_D1; SPI0_CLK_M1; I2S1_LRCK_M0; PCIE30X1_1_PERSTN_M1; BT1120_D2; CIF_D2; UART0_TX_M2; PCIE30X1_0_CLKREQN_M1; BT1120_D3; CIF_D3; SPI2_MISO_M1; UART0_RX_M2; I2C3_SCL_M2; PCIE30X1_0_WAKEN_M1; BT1120_D4; CIF_D4; SPI2_MOSI_M1; UART3_TX_M2; I2C3_SDA_M2; I2S1_SDI0_M0; PCIE30X1_0_PERSTN_M1; BT1120_D5; CIF_D5; SPI2_CLK_M1; UART3_RX_M2; I2C5_SCL_M2; I2S1_SDI1_M0; PCIE30X2_CLKREQN_M1; BT1120_D6; CIF_D6; SPI2_CS0_M1; I2C5_SDA_M2; I2S1_SDI2_M0; PCIE30X2_WAKEN_M1; BT1120_D7; CIF_D7; SPI2_CS1_M1; UART8_TX_M0; I2C6_SDA_M3; I2S1_SDI3_M0; PCIE30X2_PERSTN_M1; BT1120_CLKOUT; CIF_CLKIN; SATA2_ACT_LED_M0; SPDIF1_TX_M1; SPI0_CS1_M1; UART8_RX_M0; I2C6_SCL_M3; I2S1_SDO0_M0; PCIE30X1_0_BUTTON_RSTN; MIPI_CAMERA0_CLK_M0; CAN1_RX_M1; PWM14_M1; SPI0_CS0_M1; UART8_RTSN_M0; I2C7_SCL_M3; I2S1_SDO1_M0; PCIE30X1_1_BUTTON_RSTN; BT1120_D8; CIF_HREF; CAN1_TX_M1; PWM15_IR_M1; UART8_CTSN_M0; I2C7_SDA_M3; I2S1_SDO2_M0; PCIE20X1_2_BUTTON_RSTN; BT1120_D9; CIF_VSYNC; SPDIF0_TX_M1; PWM11_IR_M1; DP0_HPDIN_M0; UART9_TX_M1; I2S1_SDO3_M0; PCIE30X4_CLKREQN_M1; BT1120_D10; CIF_CLKOUT; SATA1_ACT_LED_M0; PWM12_M1; SPI3_MISO_M1; UART9_RX_M1; HDMI_RX_CEC_M0; PCIE30X4_WAKEN_M1; BT1120_D11; SATA0_ACT_LED_M0; PWM13_M1; SPI3_MOSI_M1; I2C5_SCL_M1; HDMI_RX_HPDOUT_M0; PCIE30X4_PERSTN_M1; BT1120_D12; SPI3_CLK_M1; I2C5_SDA_M1; HDMI_TX0_SCL_M0; PCIE20X1_2_CLKREQN_M1; BT1120_D13; SPI3_CS0_M1; I2C8_SCL_M3; HDMI_TX0_SDA_M0; PCIE20X1_2_WAKEN_M1; BT1120_D14; SPDIF1_TX_M2; PWM6_M1; SPI3_CS1_M1; I2C8_SDA_M3; HDMI_TX0_CEC_M0; PCIE20X1_2_PERSTN_M1; BT1120_D15

### Library data of the parts
C1901 = CAP NP: cap,100.00nF,+/-10%,10V,X5R,C0201; Part Reference: C1901; Manufacturer: TDK; Value: 100nF; RK PN: C0603X5R1A104K030BC; Priority: A; Tolerance: 10%; PCB Footprint: C0201; Part Type: C0201; Manufacturer PN: C0603X5R1A104K030BC; Created by: JJJ
C1902 = CAP NP: cap,100.00nF,+/-10%,10V,X5R,C0201; Part Reference: C1902; Manufacturer PN: C0603X5R1A104K030BC; Manufacturer: TDK; Value: 100nF; Tolerance: 10%; Priority: A; PCB Footprint: C0201; Created by: JJJ; Part Type: C0201; RK PN: C0603X5R1A104K030BC
C1903 = CAP NP: cap,100.00nF,+/-10%,10V,X5R,C0201; Part Reference: C1903; Manufacturer PN: C0603X5R1A104K030BC; Manufacturer: TDK; Value: 100nF; Tolerance: 10%; Priority: A; PCB Footprint: C0201; Created by: JJJ; Part Type: C0201; RK PN: C0603X5R1A104K030BC
C1905 = CAP NP: cap,100.00nF,+/-10%,10V,X5R,C0201; Part Reference: C1905; Manufacturer: TDK; Value: 100nF; RK PN: C0603X5R1A104K030BC; Priority: A; Tolerance: 10%; PCB Footprint: C0201; Part Type: C0201; Manufacturer PN: C0603X5R1A104K030BC; Created by: JJJ
R1900 = RESISTOR_Dup1: НЁУГєсД¤µзЧи,0R,+/-5%,R0201,1/20W.; Part Reference: R1900; Manufacturer: YAGEO; RK PN: RC0201JR-070RL; Priority: A; Wattage: 1/20W; Value: 0R; Part Type: НЁУГєсД¤µзЧи; Manufacturer PN: RC0201JR-070RL; Created by: YTL
R1901 = RESISTOR_Dup1: НЁУГєсД¤µзЧи,0R,+/-5%,R0201,1/20W.; Part Reference: R1901; Manufacturer: YAGEO; RK PN: RC0201JR-070RL; Priority: A; Wattage: 1/20W; Value: 0R; Part Type: НЁУГєсД¤µзЧи; Manufacturer PN: RC0201JR-070RL; Created by: YTL
R1902 = RESISTOR_Dup1: НЁУГєсД¤µзЧи,0R,+/-5%,R0201,1/20W.; Part Reference: R1902; Manufacturer PN: RC0201JR-070RL; Manufacturer: YAGEO; Wattage: 1/20W; Priority: A; Value: 0R; Created by: YTL; Part Type: НЁУГєсД¤µзЧи; RK PN: RC0201JR-070RL
R1903 = RESISTOR_Dup1: НЁУГєсД¤µзЧи,0R,+/-5%,R0201,1/20W.; Part Reference: R1903; Manufacturer PN: RC0201JR-070RL; Manufacturer: YAGEO; Wattage: 1/20W; Priority: A; Value: 0R; Created by: YTL; Part Type: НЁУГєсД¤µзЧи; RK PN: RC0201JR-070RL
R1904 = RESISTOR_Dup1: НЁУГєсД¤µзЧи,0R,+/-5%,R0201,1/20W.; Part Reference: R1904; Manufacturer PN: RC0201JR-070RL; Manufacturer: YAGEO; Wattage: 1/20W; Priority: A; Value: 0R; Created by: YTL; Part Type: НЁУГєсД¤µзЧи; RK PN: RC0201JR-070RL
R1905 = RESISTOR_Dup1: НЁУГєсД¤µзЧи,0R,+/-5%,R0201,1/20W.; Part Reference: R1905; Manufacturer: YAGEO; RK PN: RC0201JR-070RL; Priority: A; Wattage: 1/20W; Value: 0R; Part Type: НЁУГєсД¤µзЧи; Manufacturer PN: RC0201JR-070RL; Created by: YTL
R1906 = RESISTOR_Dup1: НЁУГєсД¤µзЧи,0R,+/-5%,R0201,1/20W.; Part Reference: R1906; Manufacturer PN: RC0201JR-070RL; Manufacturer: YAGEO; Wattage: 1/20W; Priority: A; Value: 0R; Created by: YTL; Part Type: НЁУГєсД¤µзЧи; RK PN: RC0201JR-070RL
R1907 = RESISTOR_Dup1: НЁУГєсД¤µзЧи,0R,+/-5%,R0201,1/20W.; Part Reference: R1907; Manufacturer PN: RC0201JR-070RL; Manufacturer: YAGEO; Wattage: 1/20W; Priority: A; Value: 0R; Created by: YTL; Part Type: НЁУГєсД¤µзЧи; RK PN: RC0201JR-070RL
R1908 = RESISTOR_Dup1: НЁУГєсД¤µзЧи,0R,+/-5%,R0201,1/20W.; Part Reference: R1908; Manufacturer PN: RC0201JR-070RL; Manufacturer: YAGEO; Wattage: 1/20W; Priority: A; Value: 0R; Created by: YTL; Part Type: НЁУГєсД¤µзЧи; RK PN: RC0201JR-070RL
R1909 = RESISTOR_Dup1: НЁУГєсД¤µзЧи,0R,+/-5%,R0201,1/20W.; Part Reference: R1909; Manufacturer PN: RC0201JR-070RL; Manufacturer: YAGEO; Wattage: 1/20W; Priority: A; Value: 0R; Created by: YTL; Part Type: НЁУГєсД¤µзЧи; RK PN: RC0201JR-070RL
R1910 = RESISTOR_Dup1: НЁУГєсД¤µзЧи,0R,+/-5%,R0201,1/20W.; Part Reference: R1910; Manufacturer PN: RC0201JR-070RL; Manufacturer: YAGEO; Wattage: 1/20W; Priority: A; Value: 0R; Created by: YTL; Part Type: НЁУГєсД¤µзЧи; RK PN: RC0201JR-070RL
R1911 = RESISTOR_Dup1: НЁУГєсД¤µзЧи,0R,+/-5%,R0201,1/20W.; Part Reference: R1911; Manufacturer PN: RC0201JR-070RL; Manufacturer: YAGEO; Wattage: 1/20W; Priority: A; Value: 0R; Created by: YTL; Part Type: НЁУГєсД¤µзЧи; RK PN: RC0201JR-070RL
R1912 = RESISTOR_Dup1: НЁУГєсД¤µзЧи,0R,+/-5%,R0201,1/20W.; Part Reference: R1912; Manufacturer PN: RC0201JR-070RL; Manufacturer: YAGEO; Wattage: 1/20W; Priority: A; Value: 0R; Created by: YTL; Part Type: НЁУГєсД¤µзЧи; RK PN: RC0201JR-070RL
R1913 = RESISTOR_Dup1: НЁУГєсД¤µзЧи,2K2,+/-5%,R0201,1/20W.; Part Reference: R1913; Manufacturer PN: RC0201JR-072K2L; Manufacturer: YAGEO; Value: 2.2K; Wattage: 1/20W; Priority: A; Created by: YTL; Part Type: НЁУГєсД¤µзЧи; RK PN: RC0201JR-072K2L
R1914 = RESISTOR_Dup1: НЁУГєсД¤µзЧи,2K2,+/-5%,R0201,1/20W.; Part Reference: R1914; Manufacturer: YAGEO; Value: 2.2K; RK PN: RC0201JR-072K2L; Priority: A; Wattage: 1/20W; Part Type: НЁУГєсД¤µзЧи; Manufacturer PN: RC0201JR-072K2L; Created by: YTL
R1915 = RESISTOR_Dup1: НЁУГєсД¤µзЧи,2K2,+/-5%,R0201,1/20W.; Part Reference: R1915; Manufacturer PN: RC0201JR-072K2L; Manufacturer: YAGEO; Value: 2.2K; Wattage: 1/20W; Priority: A; Created by: YTL; Part Type: НЁУГєсД¤µзЧи; RK PN: RC0201JR-072K2L
R1916 = RESISTOR_Dup1: НЁУГєсД¤µзЧи,2K2,+/-5%,R0201,1/20W.; Part Reference: R1916; Manufacturer: YAGEO; Value: 2.2K; RK PN: RC0201JR-072K2L; Priority: A; Wattage: 1/20W; Part Type: НЁУГєсД¤µзЧи; Manufacturer PN: RC0201JR-072K2L; Created by: YTL
R1917 = RESISTOR_Dup1: НЁУГєсД¤µзЧи,22R,+/-5%,R0201,1/20W.; Part Reference: R1917; Manufacturer: YAGEO; RK PN: RC0201JR-0722RL; Priority: A; Wattage: 1/20W; Value: 22R; Part Type: НЁУГєсД¤µзЧи; Manufacturer PN: RC0201JR-0722RL; Created by: YTL
R1918 = RESISTOR_Dup1: НЁУГєсД¤µзЧи,22R,+/-5%,R0201,1/20W.; Part Reference: R1918; Manufacturer: YAGEO; RK PN: RC0201JR-0722RL; Priority: A; Wattage: 1/20W; Value: 22R; Part Type: НЁУГєсД¤µзЧи; Manufacturer PN: RC0201JR-0722RL; Created by: YTL
R1922 = RESISTOR_Dup1: НЁУГєсД¤µзЧи,0R,+/-5%,R0402,1/16W.; Part Reference: R1922; Manufacturer PN: RC0402JR-070RL; Manufacturer: YAGEO; Wattage: 1/16W; Priority: A; PCB Footprint: R0402; Value: 0R; Created by: YTL; Part Type: НЁУГєсД¤µзЧи; RK PN: RC0402JR-070RL
U1000 = SOC_RK3588: as U1000 on sheet 18.RK3588_PCIE30_PCIE20_SATA30; Created by: YWQ; Manufacturer PN: RK3588; Part Type: SOC; RK PN: RK3588; PCB Footprint: BGA1088_23R00X23R00X2R00